# EasyEDA Pro project rk3568_xc7a100t.eprj, schematic rk3568, sheets 1 to 6 of 9

## Sheets
1 rk3568_bottom: Board Name: rk3568_xc7a100t; Create Date: 2024-07-31; Company: LT; Drawed: LT; Page Size: A3
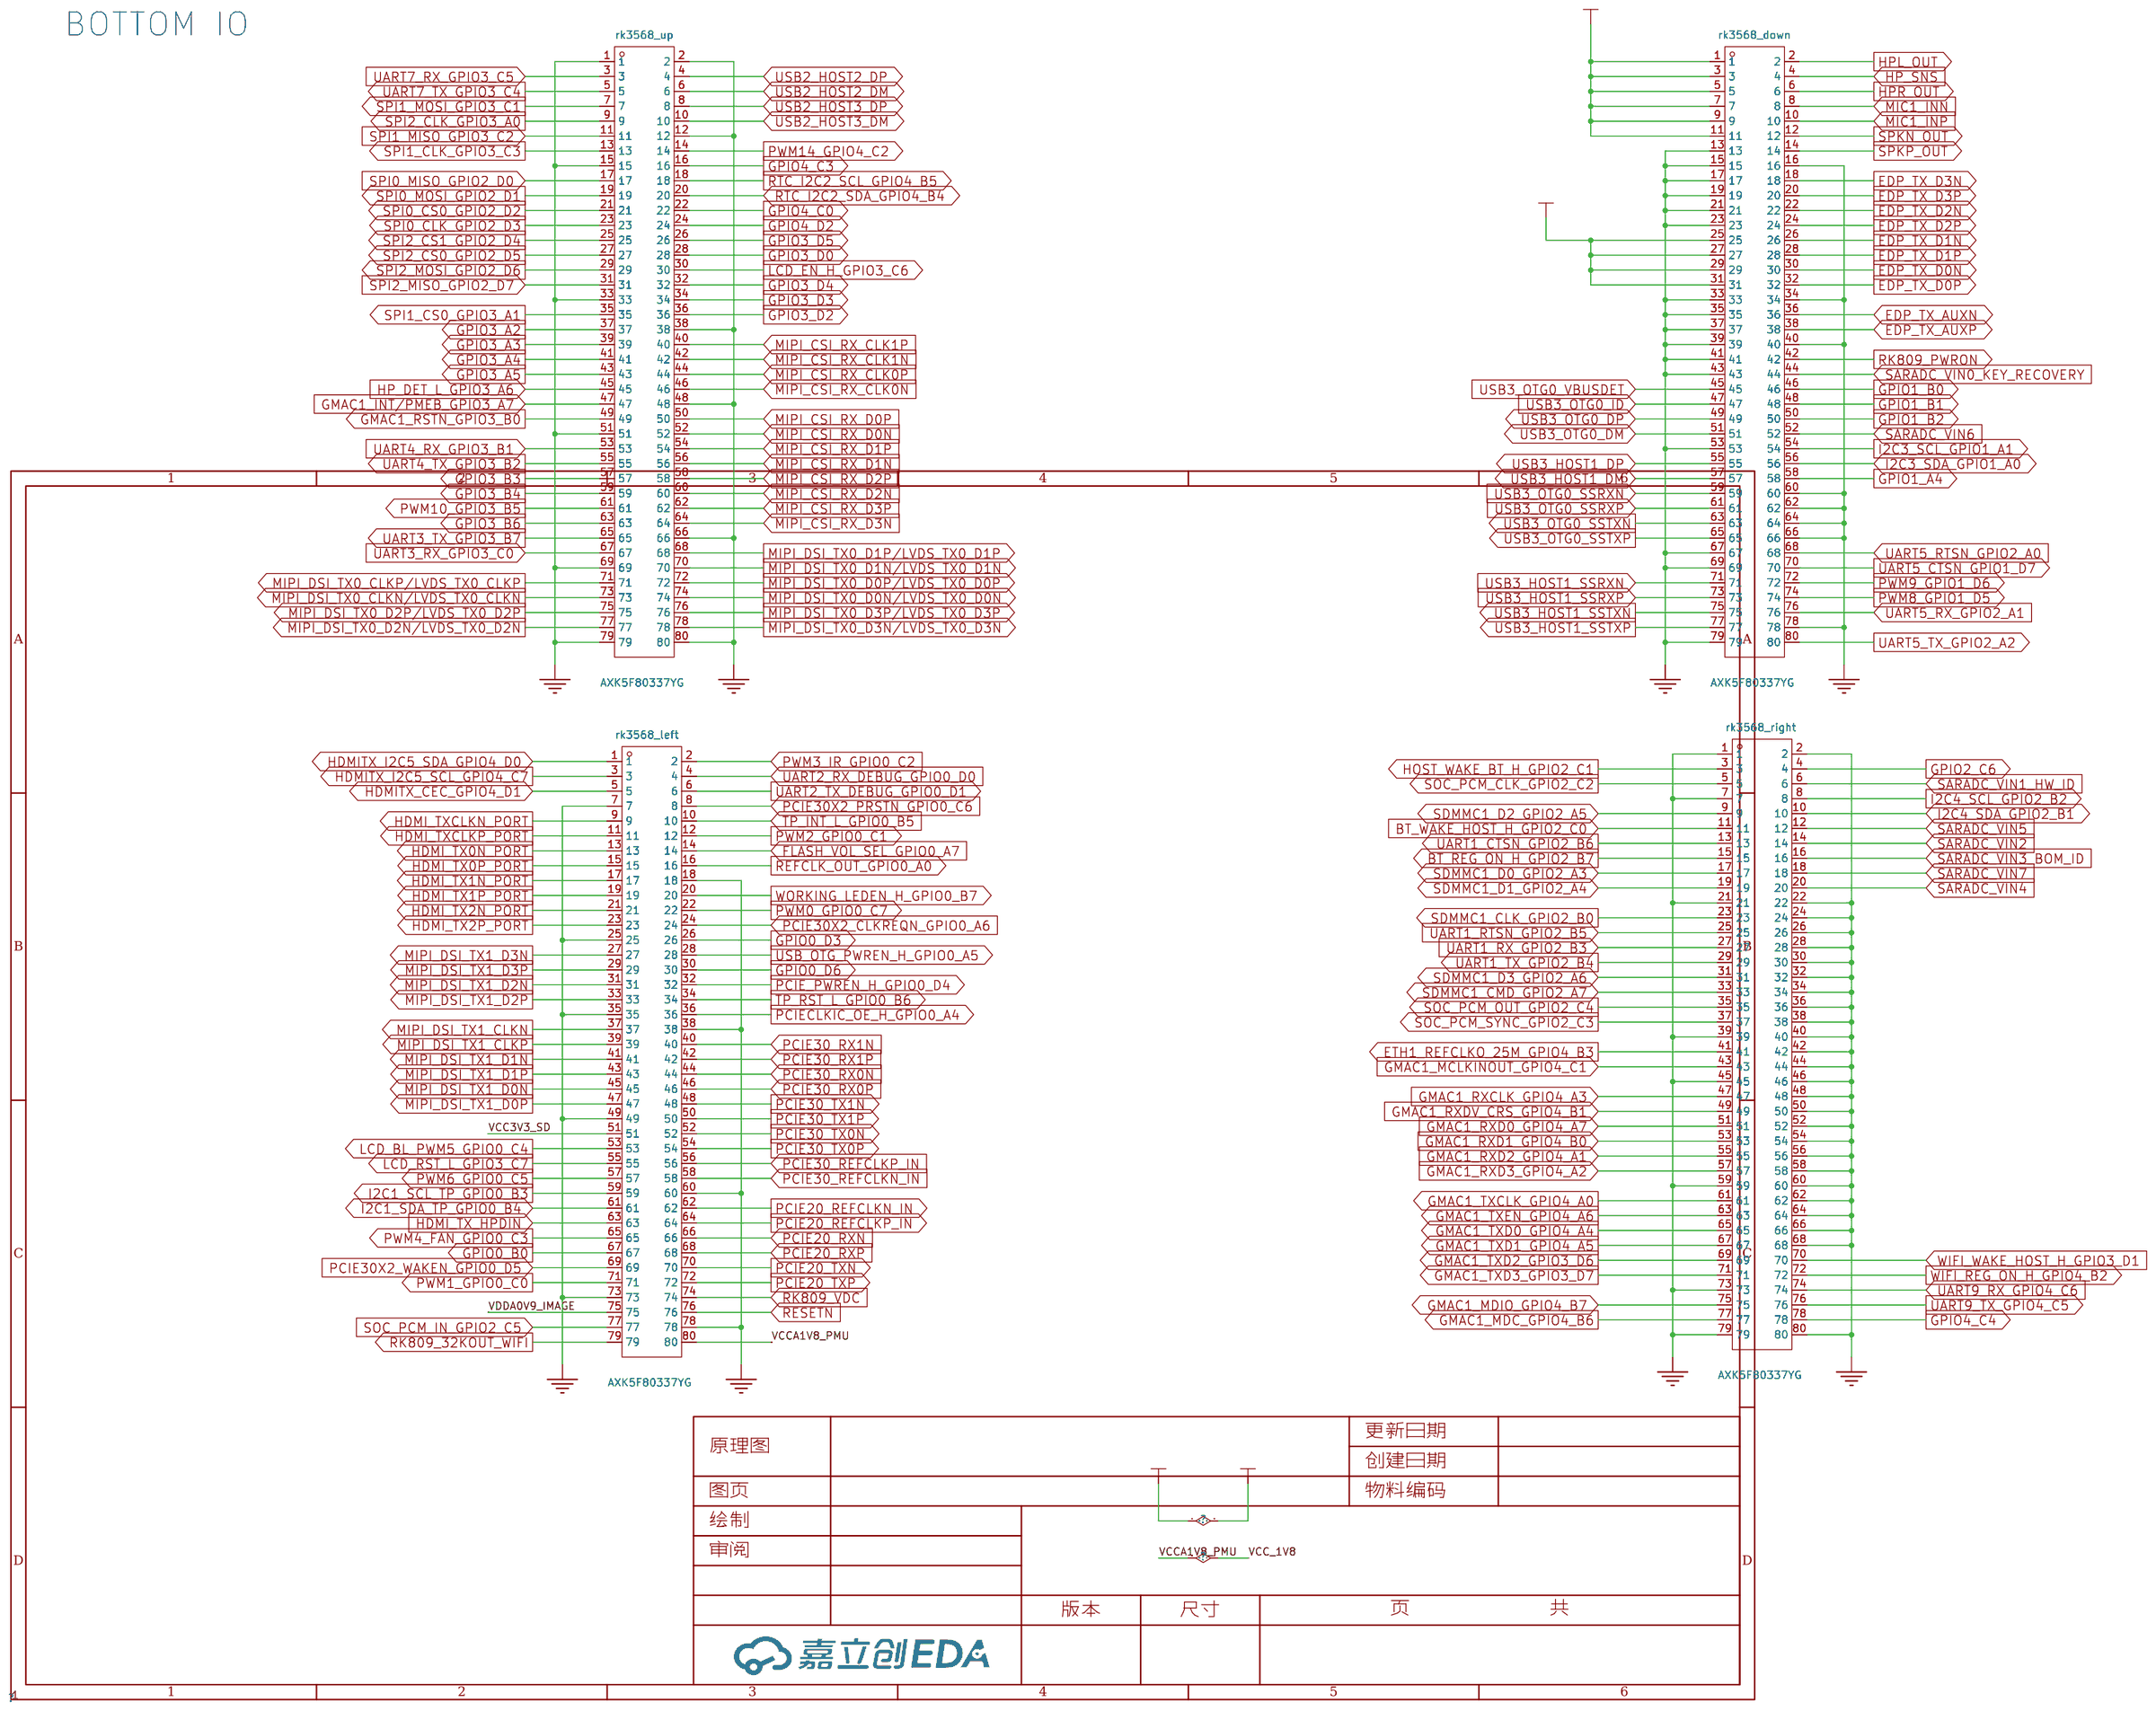
[diagram p0: rk3568_bottom]
2 rk3568_power: Create Date: 2024-08-01
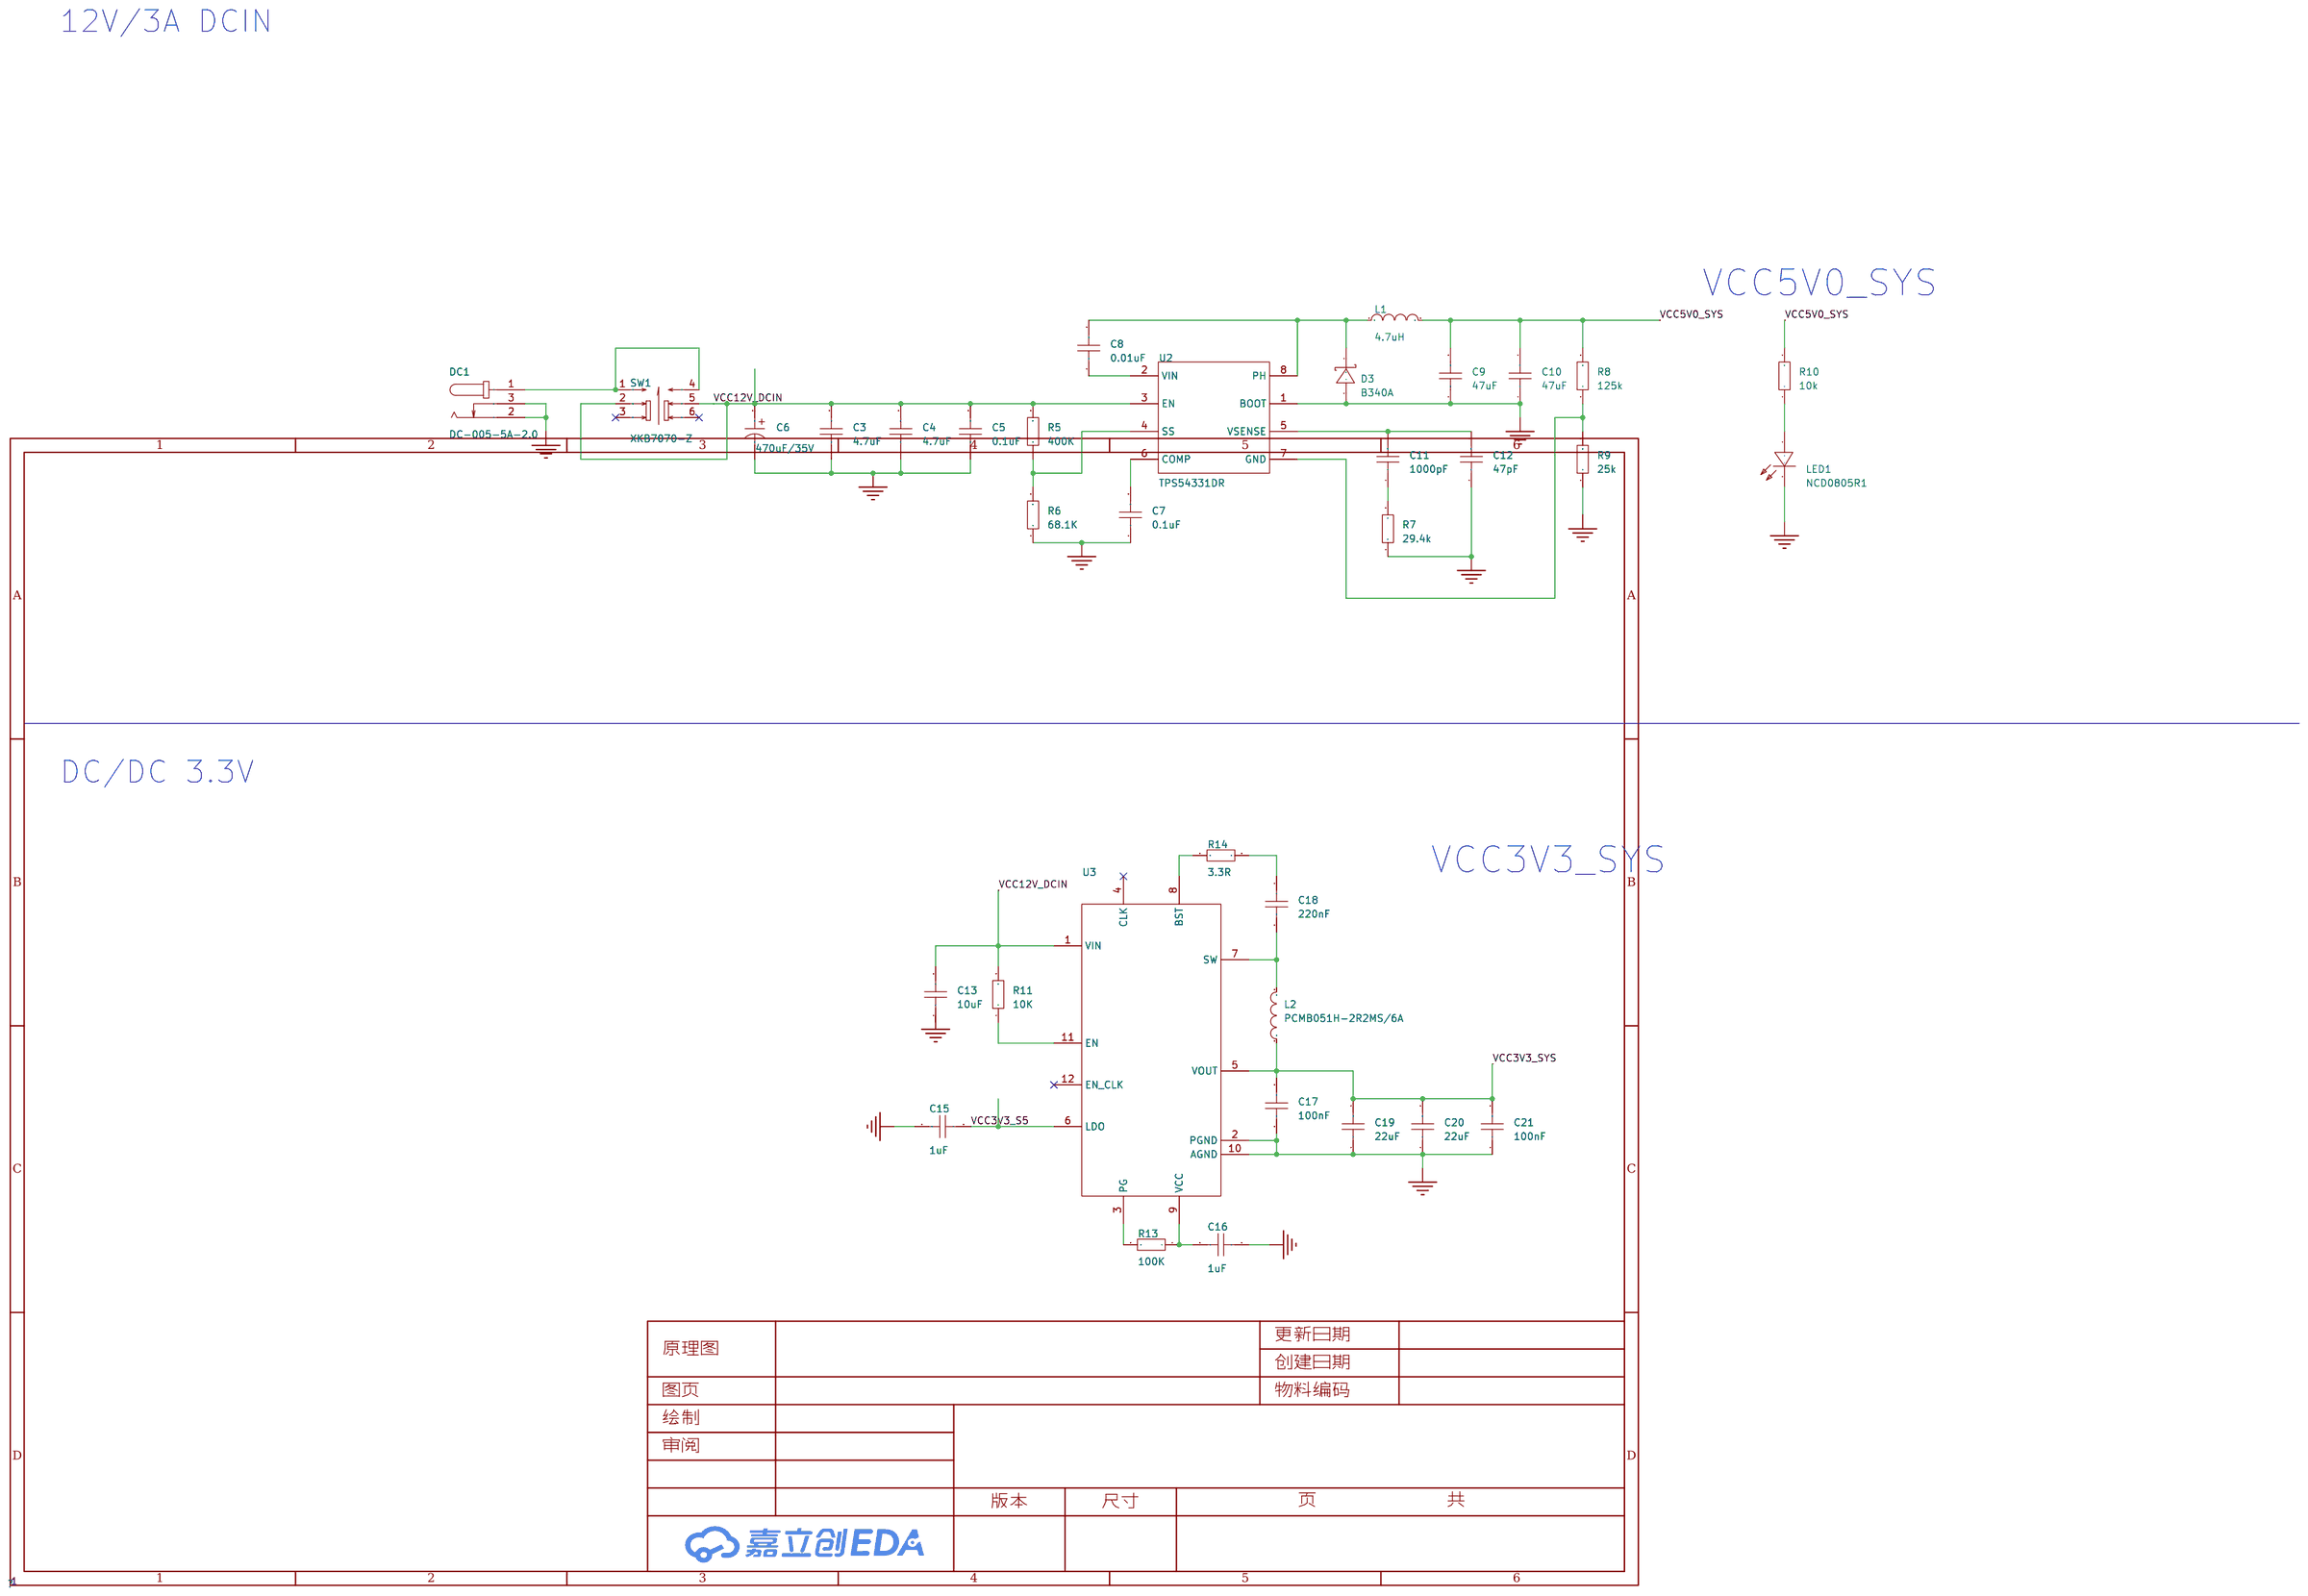
[diagram p1: rk3568_power]
3 rk3568_usb: Create Date: 2024-08-02
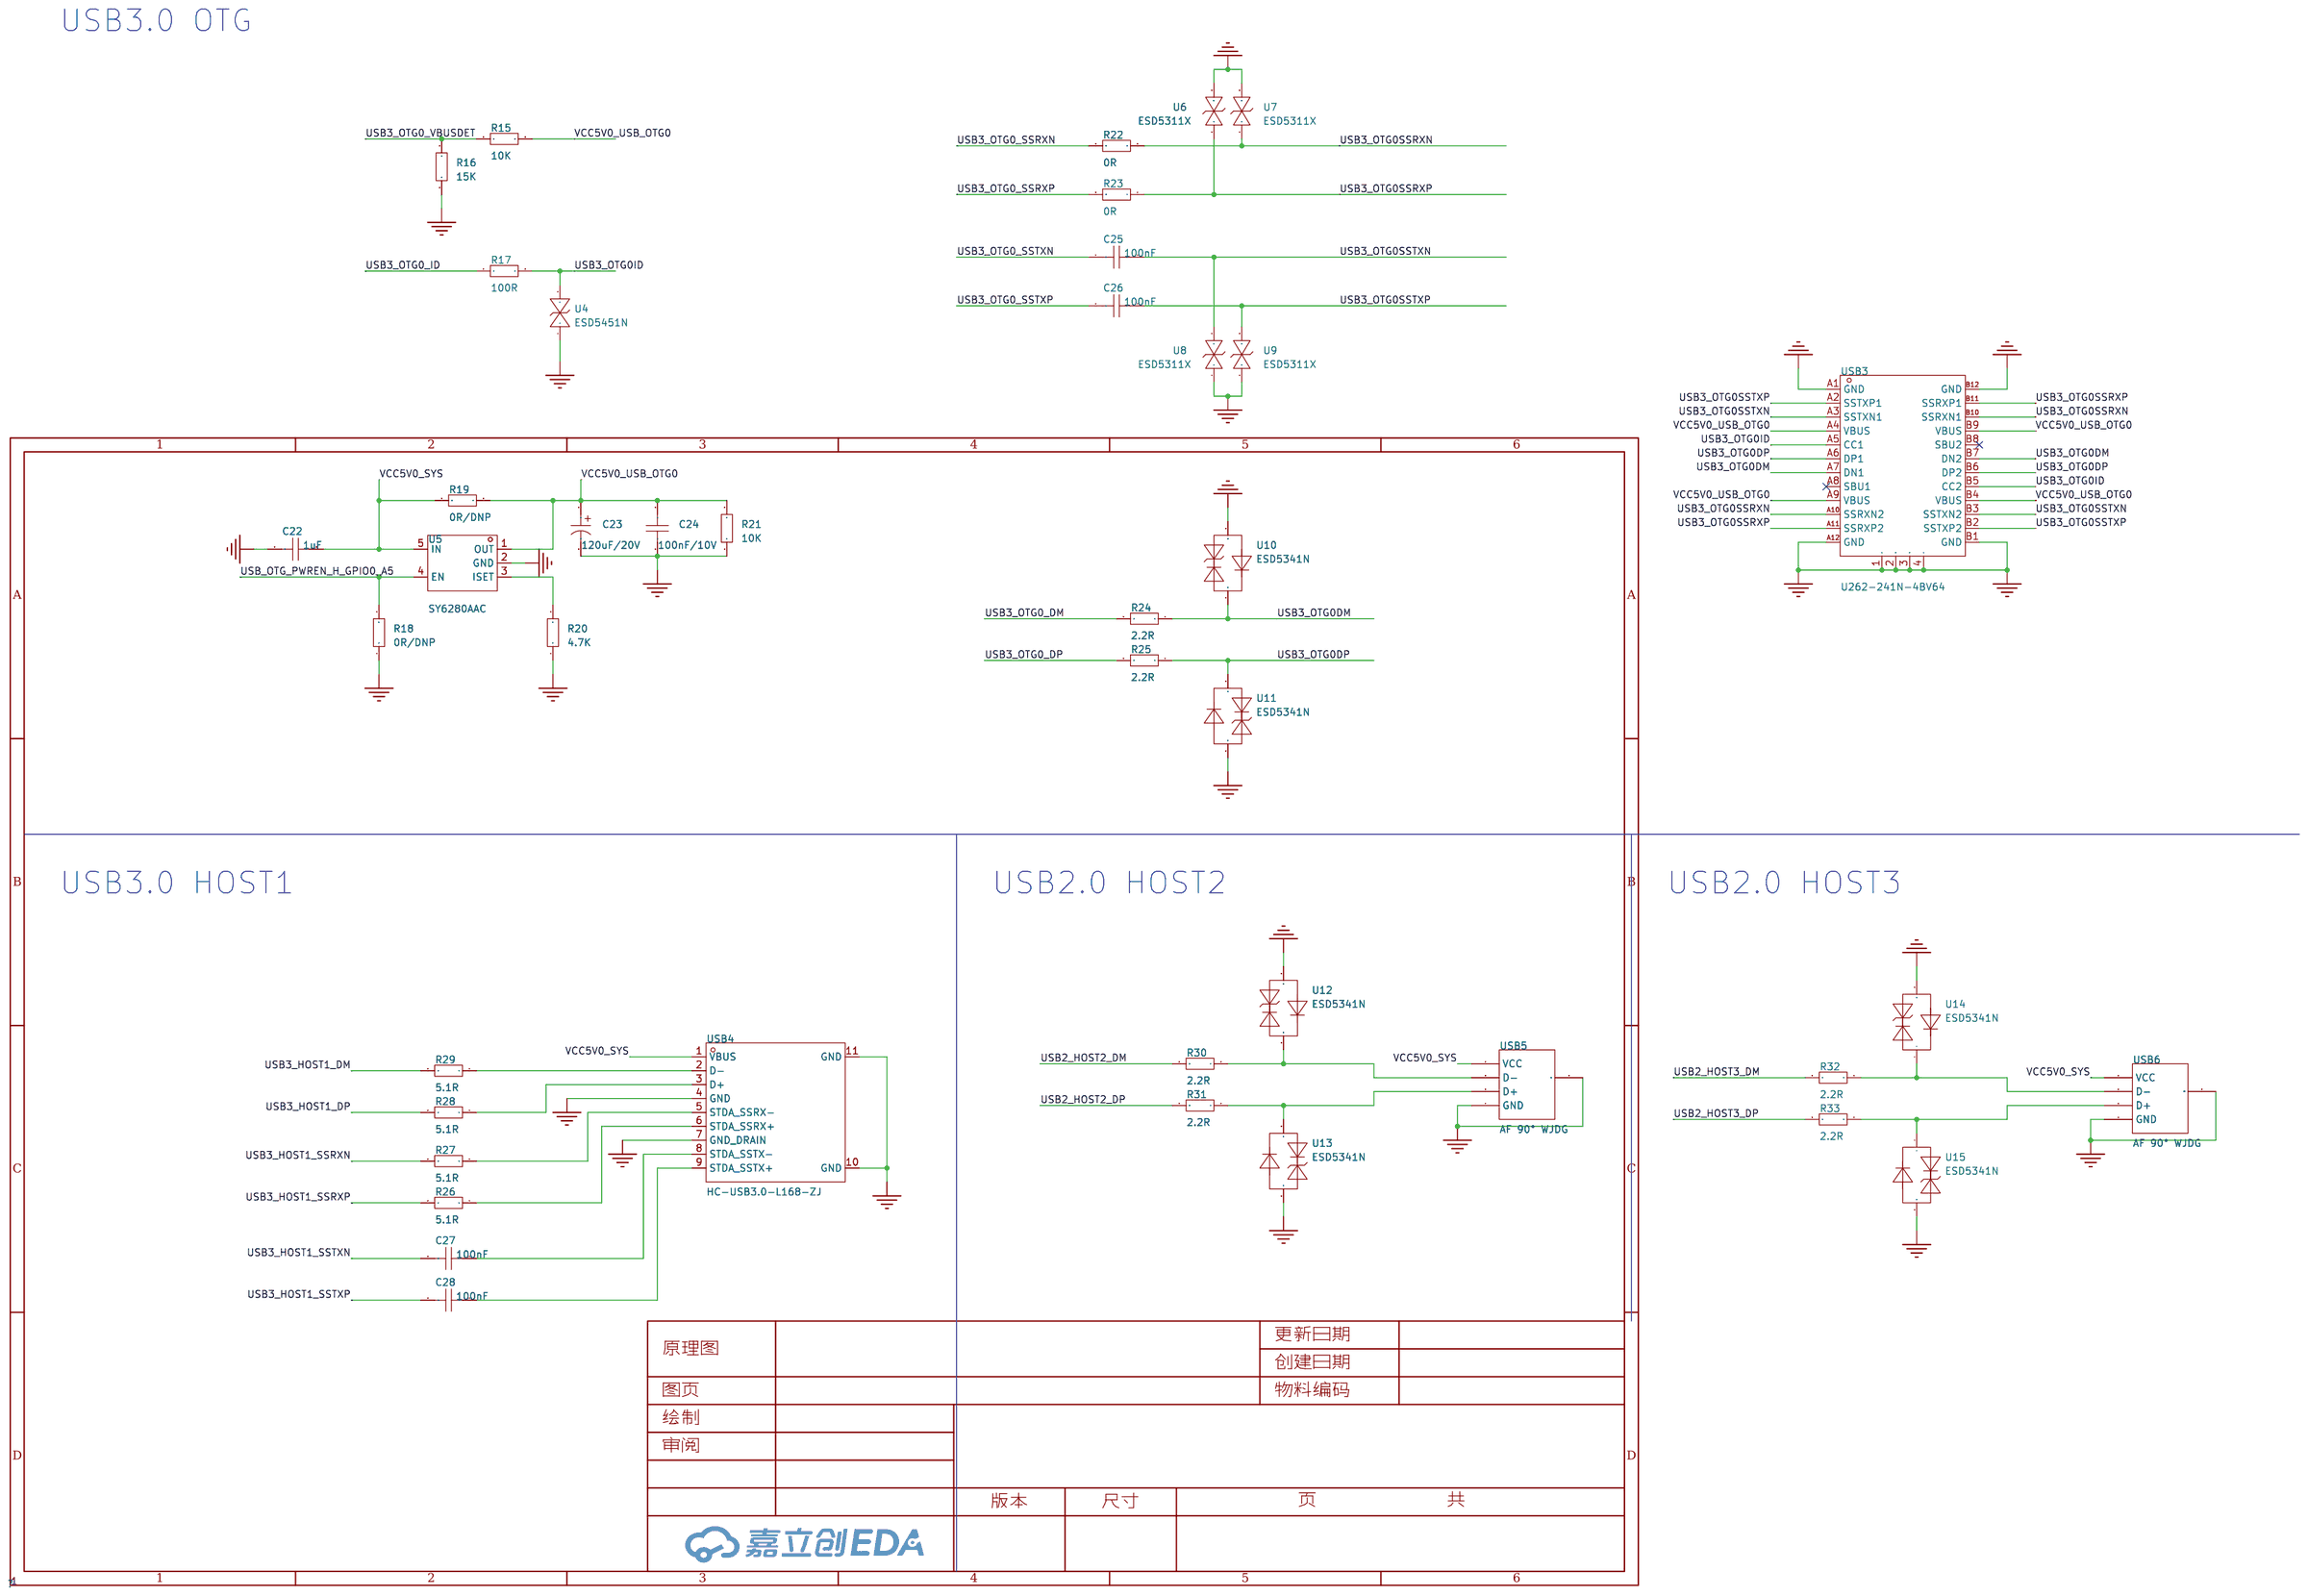
[diagram p2: rk3568_usb]
4 rk3568_mipi_hdmi: Create Date: 2024-08-02
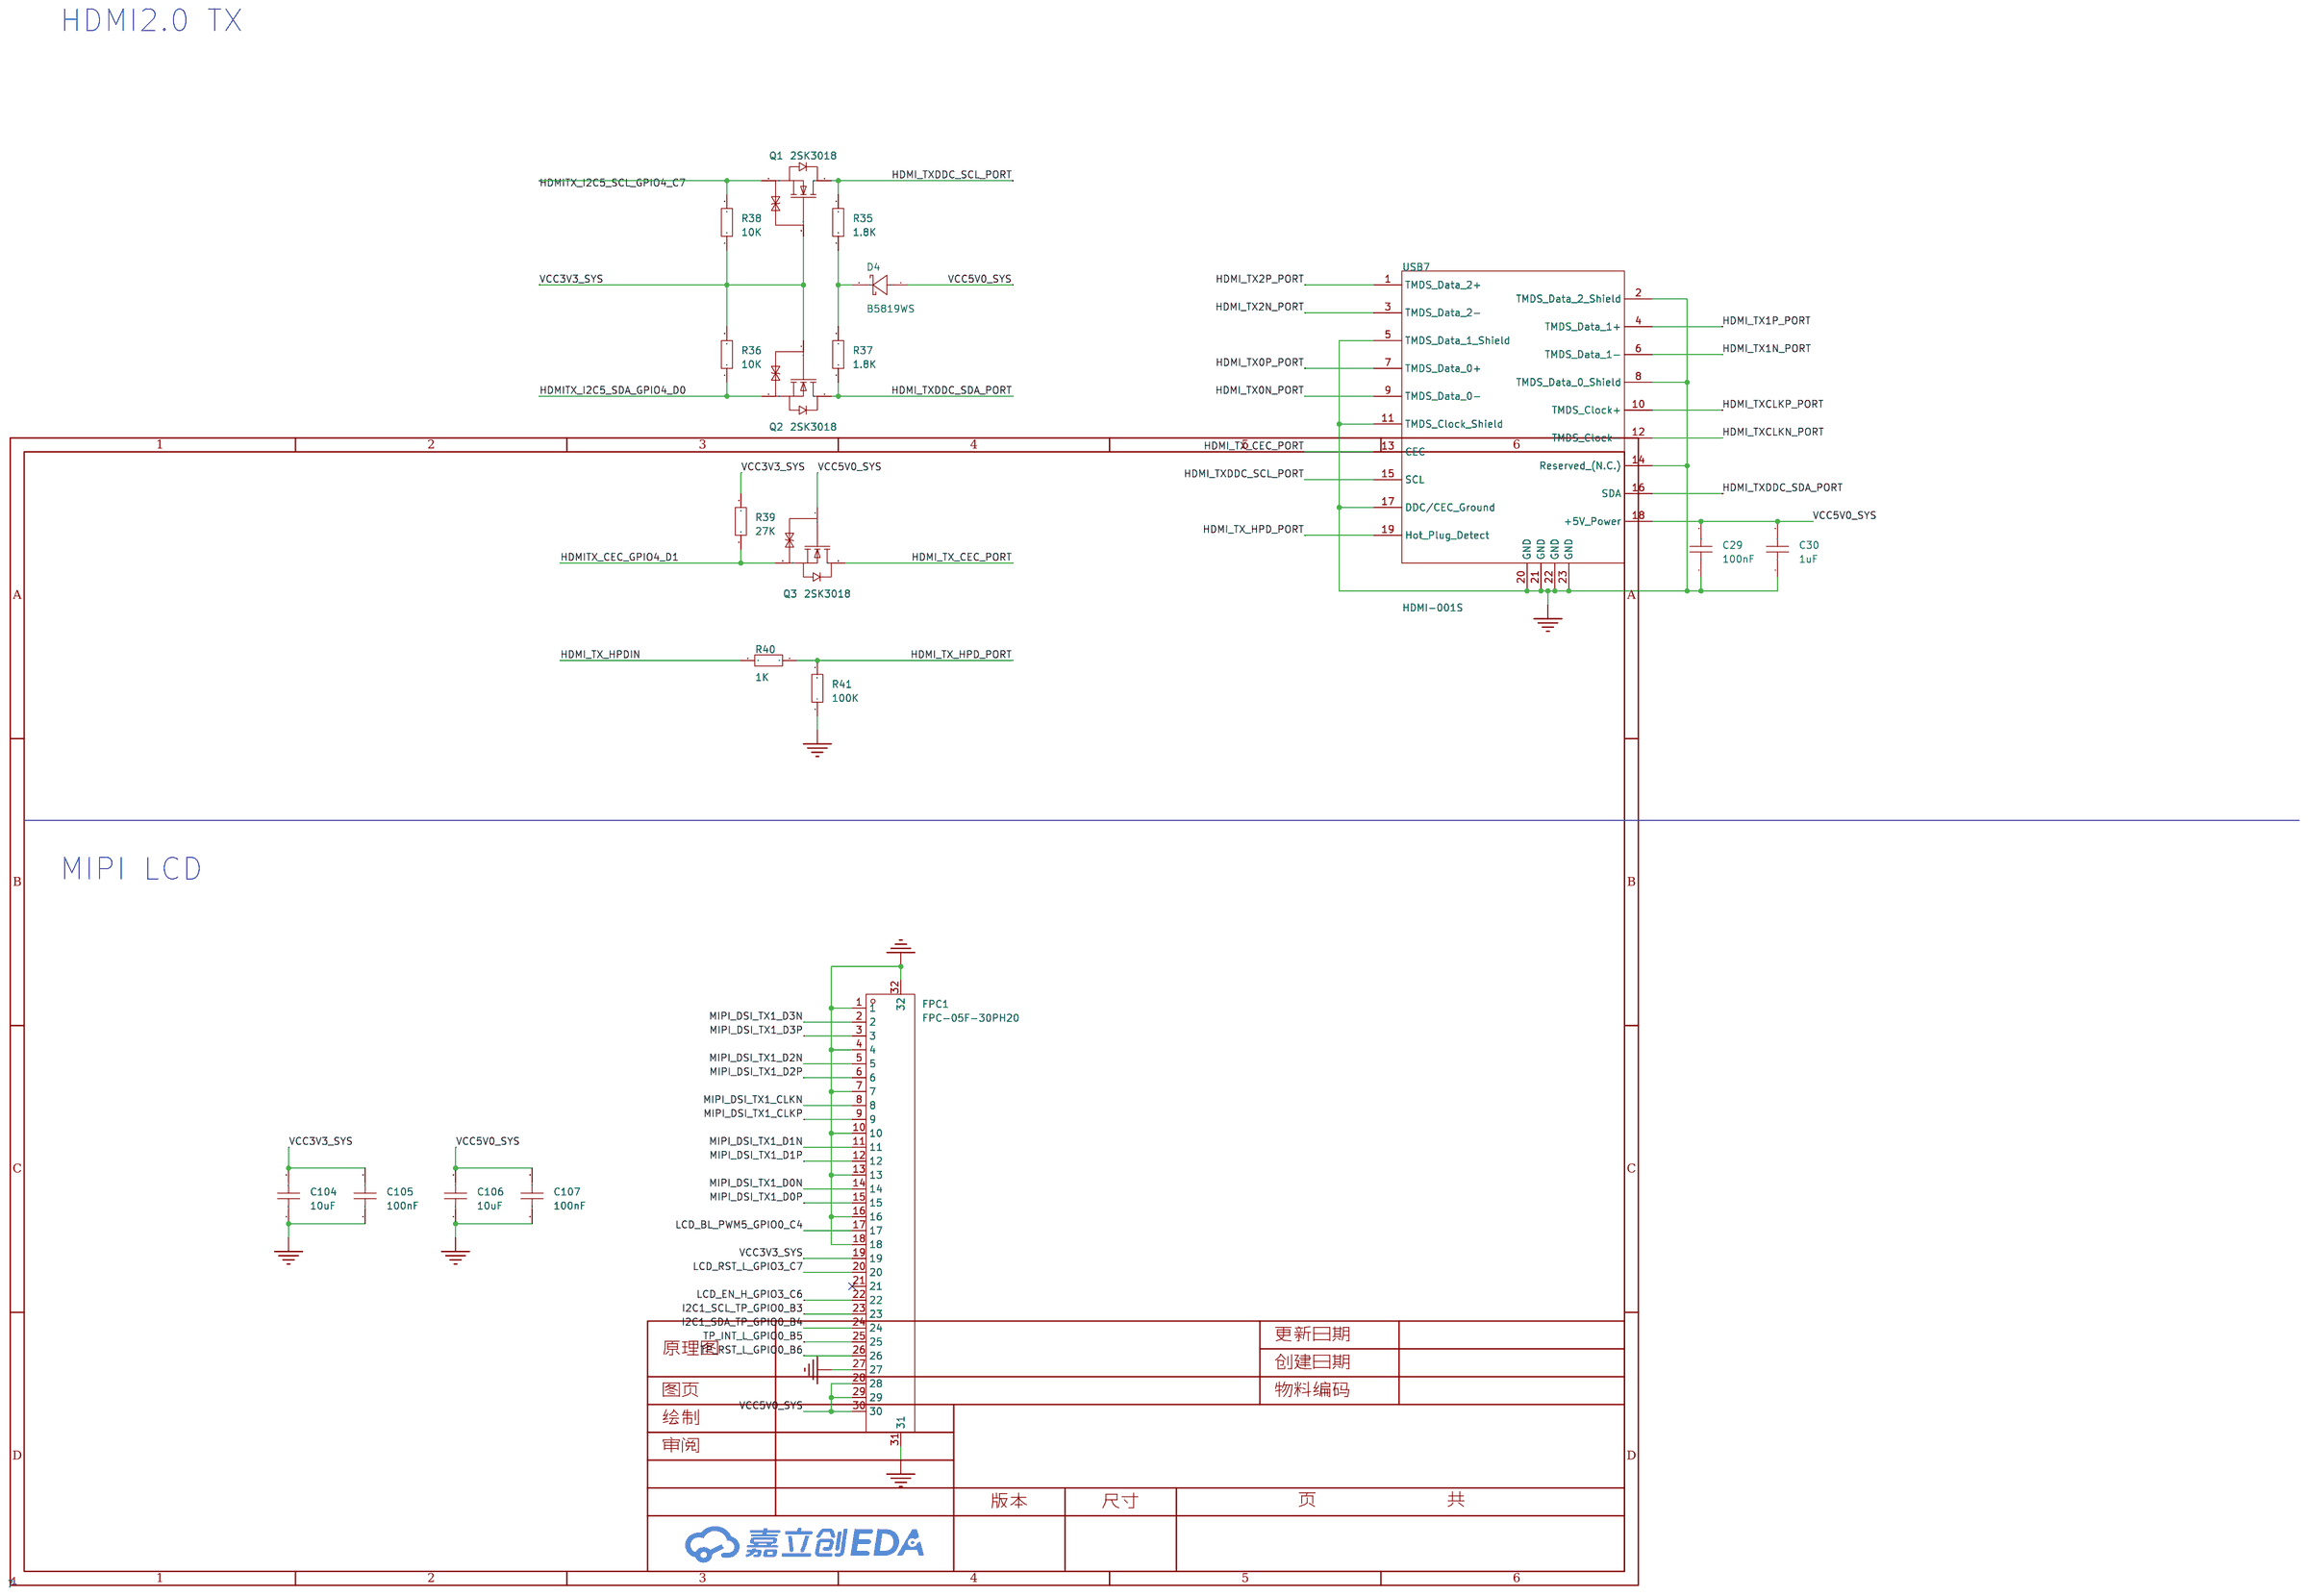
[diagram p3: rk3568_mipi_hdmi]
5 rk3568_sdio_wifi_bt: Create Date: 2024-08-02
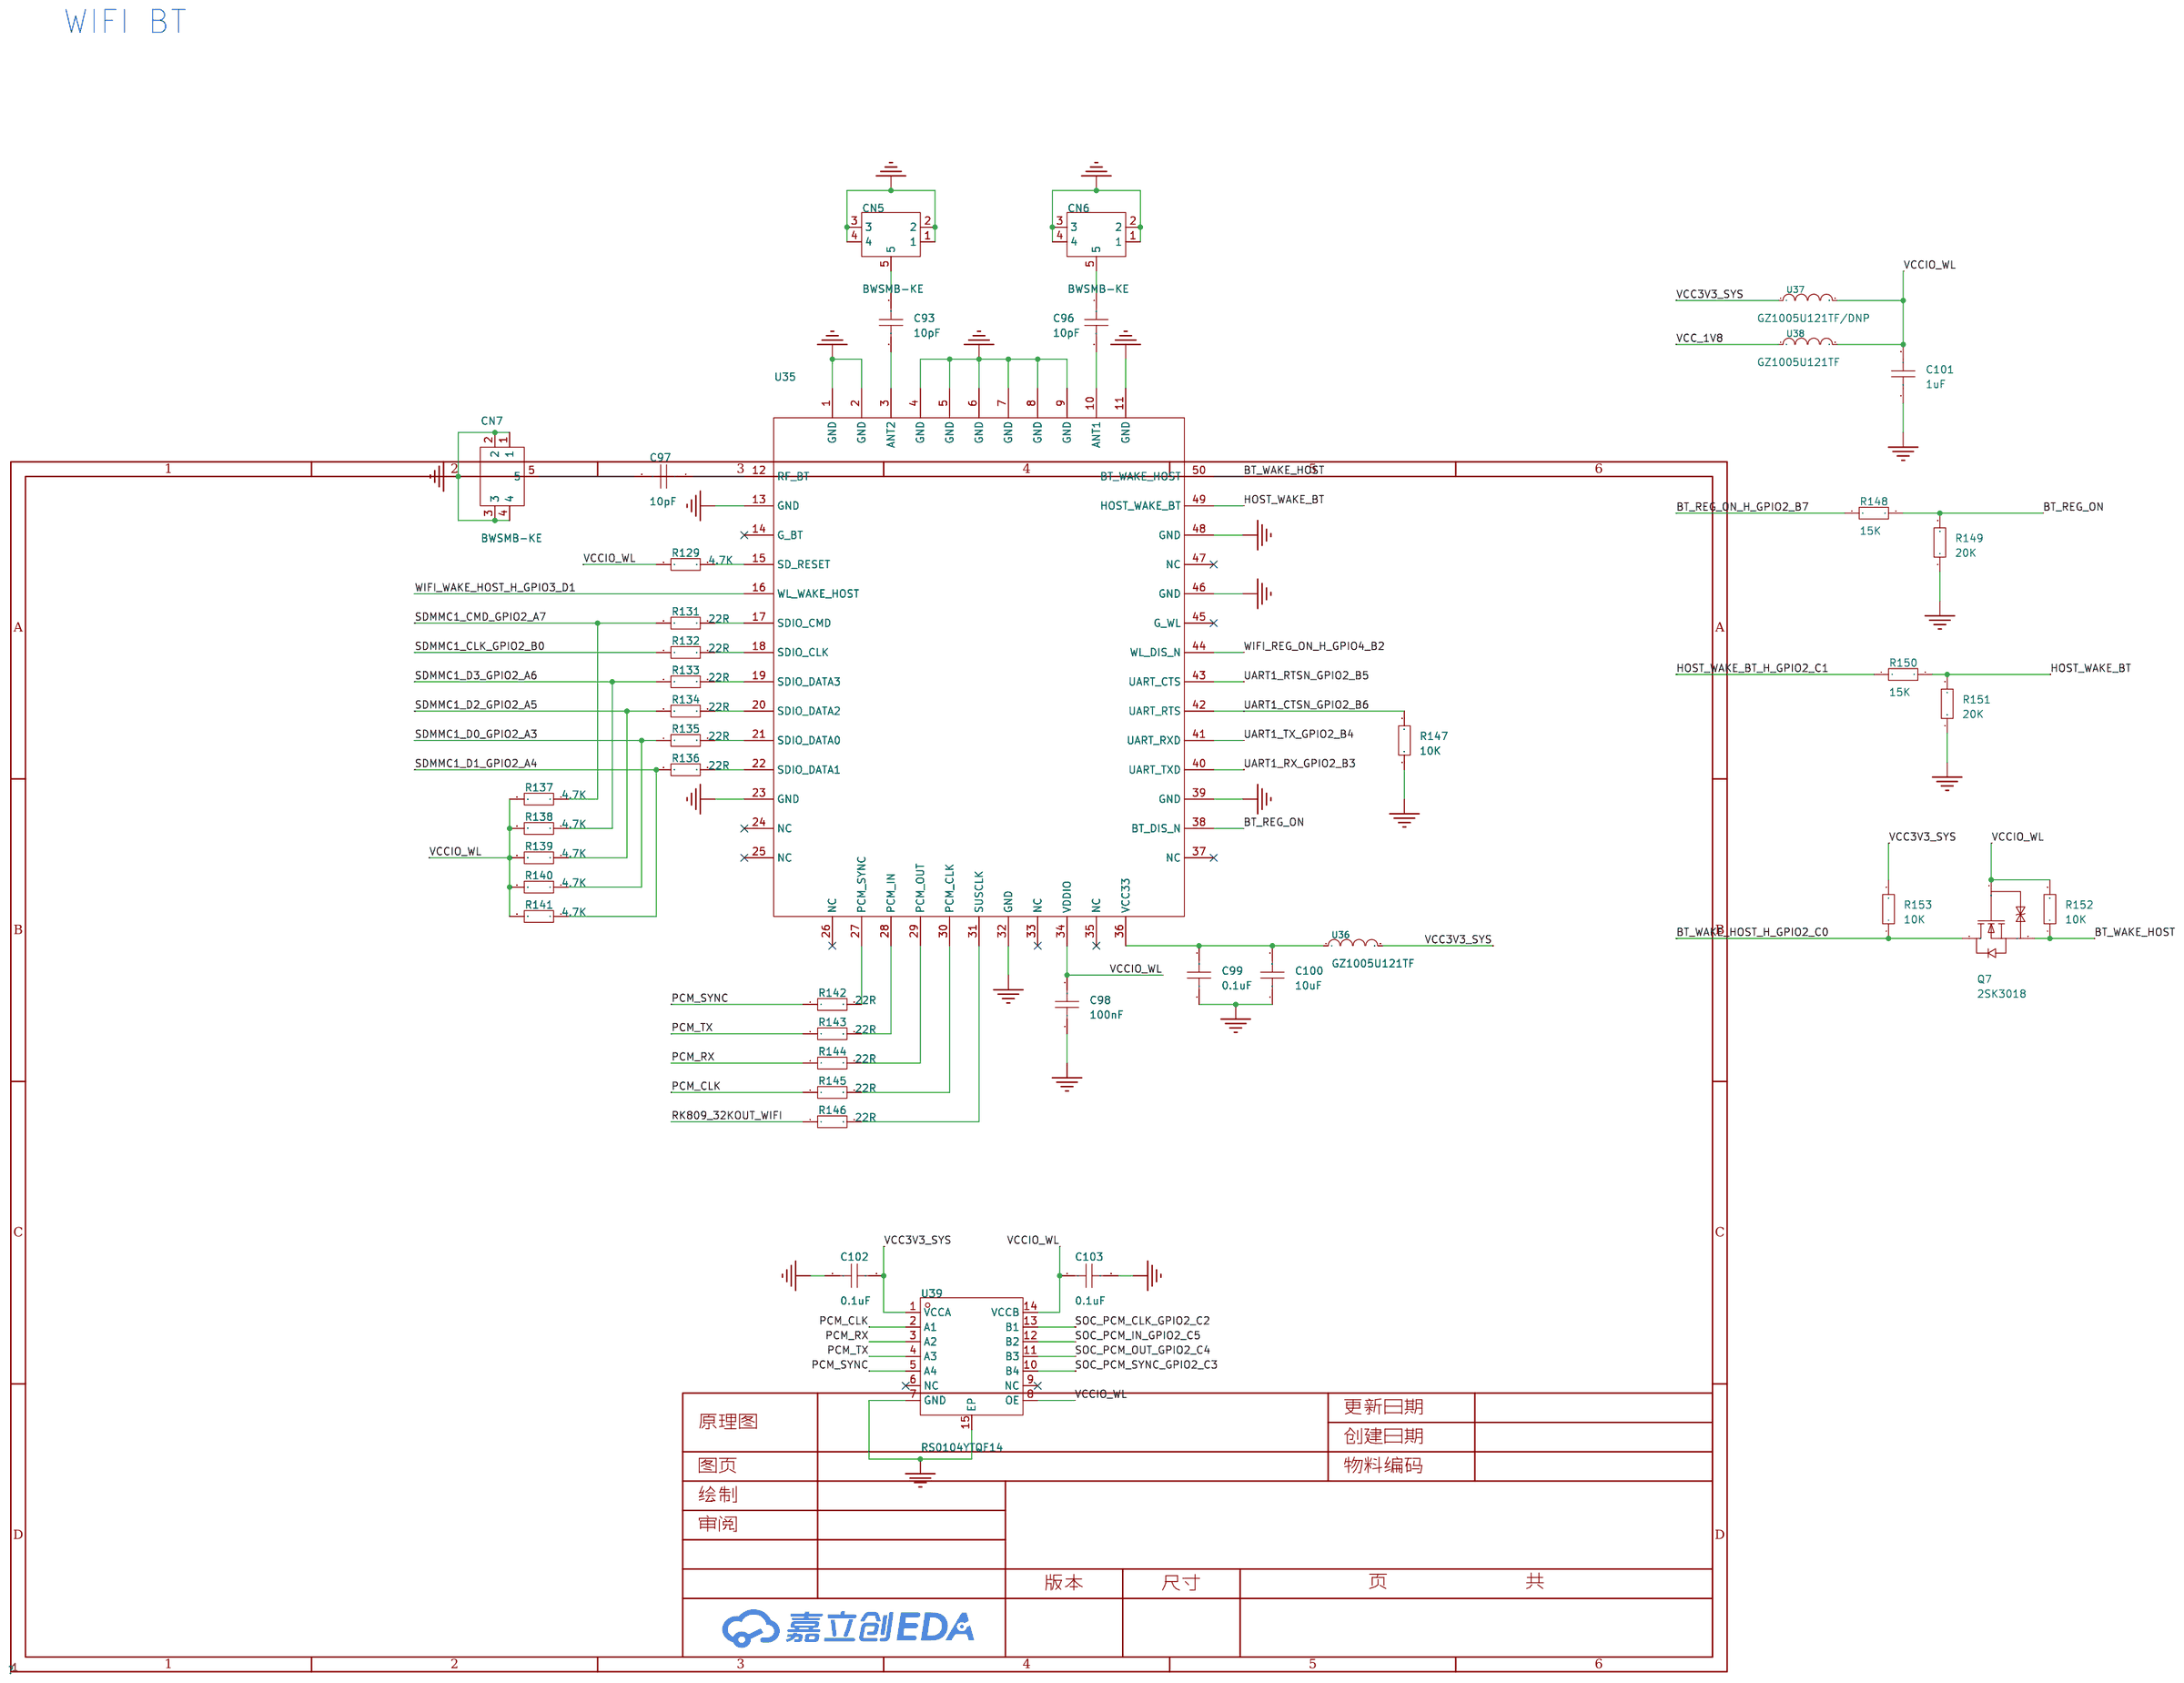
[diagram p4: rk3568_sdio_wifi_bt]
6 rk3568_gmac1_phy: Create Date: 2024-08-02
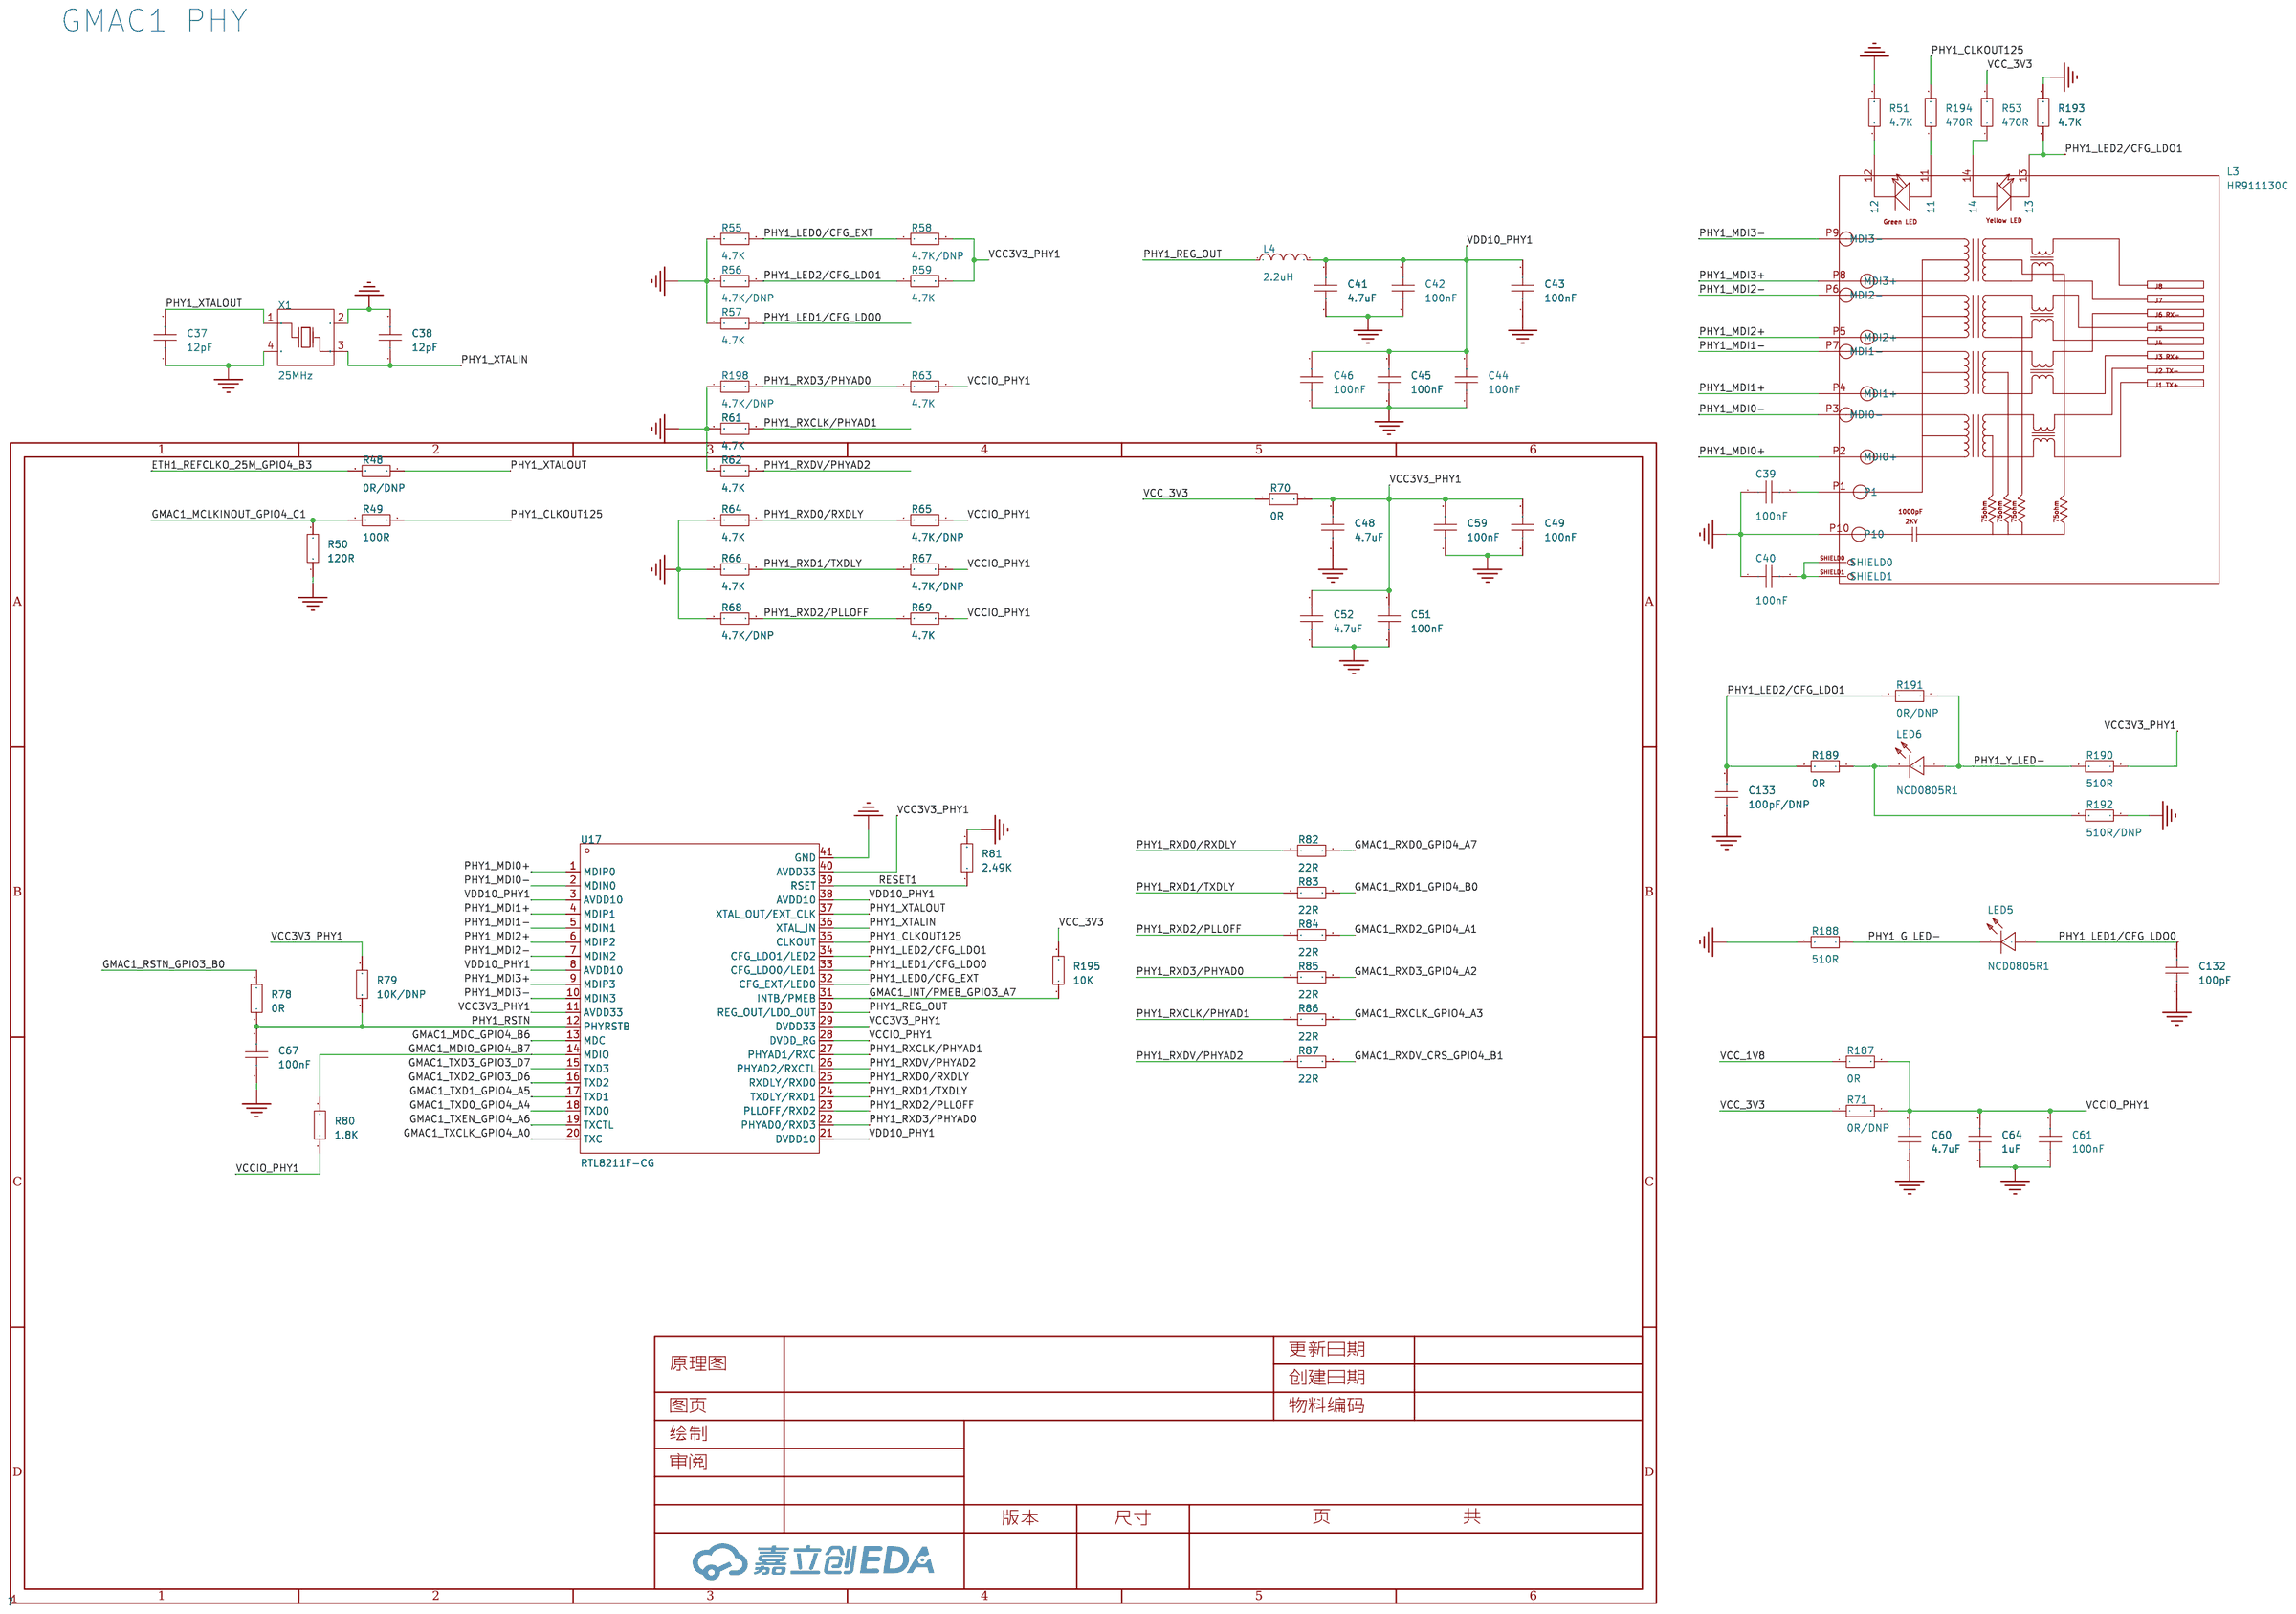
[diagram p5: rk3568_gmac1_phy]

## Parts
sheet rk3568_bottom
rk3568_down  AXK5F80337YG  [CONN-SMD_80P-P0.50_AXK5F80337YG]
rk3568_left  AXK5F80337YG  [CONN-SMD_80P-P0.50_AXK5F80337YG]
rk3568_right  AXK5F80337YG  [CONN-SMD_80P-P0.50_AXK5F80337YG]
rk3568_up  AXK5F80337YG  [CONN-SMD_80P-P0.50_AXK5F80337YG]
sheet rk3568_gmac1_phy
C37  12pF  [C0603]
C38  12pF  [C0603]
C39  100nF  [C0603]
C40  100nF  [C0603]
C41  4.7uF  [C0603]
C42  100nF  [C0603]
C43  100nF  [C0603]
C44  100nF  [C0603]
C45  100nF  [C0603]
C46  100nF  [C0603]
C48  4.7uF  [C0603]
C49  100nF  [C0603]
C51  100nF  [C0603]
C52  4.7uF  [C0603]
C59  100nF  [C0603]
C60  4.7uF  [C0603]
C61  100nF  [C0603]
C64  1uF  [C0603]
C67  100nF  [C0603]
C132  100pF  [C0603]
C133  100pF/DNP  [C0603]
L3  HR911130C  [RJ45-TH_HR911130C]
L4  2.2uH  [L0805]
LED5  NCD0805R1  [LED0805-R-RD]
LED6  NCD0805R1  [LED0805-R-RD]
R48  0R/DNP  [R0603]
R49  100R  [R0603]
R50  120R  [R0603]
R51  4.7K  [R0603]
R53  470R  [R0603]
R55  4.7K  [R0603]
R56  4.7K/DNP  [R0603]
R57  4.7K  [R0603]
R58  4.7K/DNP  [R0603]
R59  4.7K  [R0603]
R61  4.7K  [R0603]
R62  4.7K  [R0603]
R63  4.7K  [R0603]
R64  4.7K  [R0603]
R65  4.7K/DNP  [R0603]
R66  4.7K  [R0603]
R67  4.7K/DNP  [R0603]
R68  4.7K/DNP  [R0603]
R69  4.7K  [R0603]
R70  0R  [R0603]
R71  0R/DNP  [R0603]
R78  0R  [R0603]
R79  10K/DNP  [R0603]
R80  1.8K  [R0603]
R81  2.49K  [R0603]
R82  22R  [R0603]
R83  22R  [R0603]
R84  22R  [R0603]
R85  22R  [R0603]
R86  22R  [R0603]
R87  22R  [R0603]
R187  0R  [R0603]
R188  510R  [R0603]
R189  0R  [R0603]
R190  510R  [R0603]
R191  0R/DNP  [R0603]
R192  510R/DNP  [R0603]
R193  4.7K  [R0603]
R194  470R  [R0603]
R195  10K  [R0603]
R198  4.7K/DNP  [R0603]
U17  RTL8211F-CG  [WQFN-40_L5.0-W5.0-P0.4-BL-EP]
X1  25MHz  [OSC-SMD_4P-L3.2-W2.5-BL]
sheet rk3568_mipi_hdmi
C29  100nF  [C0603]
C30  1uF  [C0603]
C104  10uF  [C0603]
C105  100nF  [C0603]
C106  10uF  [C0603]
C107  100nF  [C0603]
D4  B5819WS  [SOD-323_L1.7-W1.3-LS2.5-FD]
FPC1  FPC-05F-30PH20  [FPC-SMD_30P-P0.50_XUNPU_FPC-05F-30PH20]
Q1  2SK3018  [SOT-323-3_L2.0-W1.3-P1.30-LS2.1-BR]
Q2  2SK3018  [SOT-323-3_L2.0-W1.3-P1.30-LS2.1-BR]
Q3  2SK3018  [SOT-323-3_L2.0-W1.3-P1.30-LS2.1-BR]
R35  1.8K  [R0603]
R36  10K  [R0603]
R37  1.8K  [R0603]
R38  10K  [R0603]
R39  27K  [R0603]
R40  1K  [R0603]
R41  100K  [R0603]
USB7  HDMI-001S  [HDMI-SMD_HDMI-001S]
sheet rk3568_power
C3  4.7uF  [C0603]
C4  4.7uF  [C0603]
C5  0.1uF  [C0603]
C6  470uF/35V  [CAP-SMD_BD6.3-L6.6-W6.6-LS7.4-FD]
C7  0.1uF  [C0603]
C8  0.01uF  [C0603]
C9  47uF  [C0603]
C10  47uF  [C0603]
C11  1000pF  [C0603]
C12  47pF  [C0603]
C13  10uF  [C0603]
C15  1uF  [C0603]
C16  1uF  [C0603]
C17  100nF  [C0603]
C18  220nF  [C0603]
C19  22uF  [C0603]
C20  22uF  [C0603]
C21  100nF  [C0603]
D3  B340A  [SMA_L4.3-W2.6-LS5.1-RD]
DC1  DC-005-5A-2.0  [DC-IN-TH_DC-005-5A-2.0]
L1  4.7uH  [L0603]
L2  PCMB051H-2R2MS/6A  [IND-SMD_L5.4-W5.2]
LED1  NCD0805R1  [LED0805-R-RD]
R5  400K  [R0603]
R6  68.1K  [R0603]
R7  29.4k  [R0603]
R8  125k  [R0603]
R9  25k  [R0603]
R10  10k  [R0603]
R11  10K  [R0603]
R13  100K  [R0603]
R14  3.3R  [R0603]
SW1  XKB7070-Z  [SW-TH_6P-L7.0-W7.0-P2.00]
U2  TPS54331DR  [SOIC-8_L5.0-W4.0-P1.27-LS6.0-BL]
U3  -  [QFN-12_NB680_MNP]
sheet rk3568_sdio_wifi_bt
C93  10pF  [C0603]
C96  10pF  [C0603]
C97  10pF  [C0603]
C98  100nF  [C0603]
C99  0.1uF  [C0603]
C100  10uF  [C0603]
C101  1uF  [C0603]
C102  0.1uF  [C0603]
C103  0.1uF  [C0603]
CN5  BWSMB-KE  [SMA-TH_SMA-KHD]
CN6  BWSMB-KE  [SMA-TH_SMA-KHD]
CN7  BWSMB-KE  [SMA-TH_SMA-KHD]
Q7  2SK3018  [SOT-23-3_L2.9-W1.4-P1.90-LS2.6-BR]
R129  4.7K  [R0603]
R131  22R  [R0603]
R132  22R  [R0603]
R133  22R  [R0603]
R134  22R  [R0603]
R135  22R  [R0603]
R136  22R  [R0603]
R137  4.7K  [R0603]
R138  4.7K  [R0603]
R139  4.7K  [R0603]
R140  4.7K  [R0603]
R141  4.7K  [R0603]
R142  22R  [R0603]
R143  22R  [R0603]
R144  22R  [R0603]
R145  22R  [R0603]
R146  22R  [R0603]
R147  10K  [R0603]
R148  15K  [R0603]
R149  20K  [R0603]
R150  15K  [R0603]
R151  20K  [R0603]
R152  10K  [R0603]
R153  10K  [R0603]
U35  -  [RTL8852BS]
U36  GZ1005U121TF  [L0402]
U37  GZ1005U121TF/DNP  [L0402]
U38  GZ1005U121TF  [L0402]
U39  RS0104YTQF14  [VQFN-14_L3.5-W3.5-P0.50-BL-EP2.0]
sheet rk3568_usb
C22  1uF  [C0603]
C23  120uF/20V  [CAP-SMD_BD6.3-L6.6-W6.6-LS7.4-FD]
C24  100nF/10V  [C0603]
C25  100nF  [C0603]
C26  100nF  [C0603]
C27  100nF  [C0603]
C28  100nF  [C0603]
R15  10K  [R0603]
R16  15K  [R0603]
R17  100R  [R0603]
R18  0R/DNP  [R0603]
R19  0R/DNP  [R0603]
R20  4.7K  [R0603]
R21  10K  [R0603]
R22  0R  [R0603]
R23  0R  [R0603]
R24  2.2R  [R0603]
R25  2.2R  [R0603]
R26  5.1R  [R0603]
R27  5.1R  [R0603]
R28  5.1R  [R0603]
R29  5.1R  [R0603]
R30  2.2R  [R0603]
R31  2.2R  [R0603]
R32  2.2R  [R0603]
R33  2.2R  [R0603]
U4  ESD5451N  [X1-DFN1006-2_L1.0-W0.6-P0.65-BI]
U5  SY6280AAC  [SOT-23-5_L3.0-W1.7-P0.95-LS2.8-BL]
U6  ESD5311X  [DFN1006-2L-BI]
U7  ESD5311X  [DFN1006-2L-BI]
U8  ESD5311X  [DFN1006-2L-BI]
U9  ESD5311X  [DFN1006-2L-BI]
U10  ESD5341N  [DFN1006-2L-RD]
U11  ESD5341N  [DFN1006-2L-RD]
U12  ESD5341N  [DFN1006-2L-RD]
U13  ESD5341N  [DFN1006-2L-RD]
U14  ESD5341N  [DFN1006-2L-RD]
U15  ESD5341N  [DFN1006-2L-RD]
USB3  U262-241N-4BV64  [USB-C-SMD_TYC-324G]
USB4  HC-USB3.0-L168-ZJ  [USB3.0-A-TH_HC-USB3.0-L168-ZJ]
USB5  AF 90° WJDG  [USB-A-TH_AF-WJDG]
USB6  AF 90° WJDG  [USB-A-TH_AF-WJDG]

## Library data of the parts
rk3568_down rk3568_left rk3568_right rk3568_up = AXK5F80337YG: LCSC Part Name: 间距:0.5mm 母 立贴; Supplier Part: C425110; Manufacturer: PANASONIC(松下); Supplier Footprint: SMD,P=0.5mm; JLCPCB Part Class: 扩展库; Datasheet: https://atta.szlcsc.com/upload/public/pdf/source/20220311/6F5DC41F043C9CF6954EB51995931AE2.pdf; Supplier: LCSC; Pitch: 0.5mm; Gender: 母; Mounting Style: 立贴; Number of Rows: 2; Contact Plating: 金
C3-C5 C7-C13 C15-C22 C24-C30 C37-C46 C48 C49 C51 C52 C59-C61 C64 C67 C93 C96-C107 C132 C133 = CAP_0603: Supplier Footprint: 0603
L3 = HR911130C: LCSC Part Name: 弯插 带LED; Supplier Part: C50933; Manufacturer: HANRUN(汉仁); Supplier Footprint: 插件; JLCPCB Part Class: 扩展库; Datasheet: https://atta.szlcsc.com/upload/public/pdf/source/20240108/FEC80AF9B295891E58BF4ACD53537D33.pdf; Supplier: LCSC; Connector Type: RJ45插座; Number of Ports: 1; Mounting Style: 弯插; Shielding: 有屏蔽; LED: 带LED
L4 = CMI201209U2R2KT: LCSC Part Name: 2.2uH ±10%; Supplier Part: C1043; Manufacturer: FH(风华); Supplier Footprint: 0805; JLCPCB Part Class: 扩展库; Datasheet: https://atta.szlcsc.com/upload/public/pdf/source/20230223/B5A9234764BD8EE53116685FAFCB16FA.pdf; Supplier: LCSC; Tolerance: ±10%; Rated Current: 50mA; DC Resistance (DCR): 600mΩ; Q @ Freq: 35@10MHz; Frequency - Self Resonant: 50MHz
LED1 LED5 LED6 = NCD0805R1: Supplier Part: C84256; Manufacturer: 国星光电; Supplier Footprint: 0805; JLCPCB Part Class: 基础库; Datasheet: https://atta.szlcsc.com/upload/public/pdf/source/20200820/C84256_F0A75A43B3EAD75808600A0514C76B99.pdf; Supplier: LCSC; Emitted Color: 红色; Forward Voltage (VF): 1.6V~2.6V; Power Dissipation: 65mW; Forward Current: 20mA; Dominant Wavelength: 615nm~630nm; Diode Configuration: 独立二极管; Lens Color: 无色透明透镜; Luminous Intensity: 67mcd~195mcd; Viewing Angle: 130°; Operating Temperature: -30℃~+85℃
R5-R11 R13-R33 R35-R41 R48-R51 R53 R55-R59 R61-R71 R78-R87 R129 R131-R153 R187-R195 R198 = Res_0603: Supplier Footprint: 0603
U17 = RTL8211F-CG: LCSC Part Name: 集成10/100/1000M以太网精密收发器; Supplier Part: C187932; Manufacturer: REALTEK(瑞昱); Supplier Footprint: WQFN-40-EP(5x5); JLCPCB Part Class: 扩展库; Datasheet: https://atta.szlcsc.com/upload/public/pdf/source/20190902/C187932_1913F3711F05FE1324DF2946D70D648D.pdf; Supplier: LCSC
X1 = X322525MOB4SI: LCSC Part Name: 25MHz ±10ppm 12pF; Supplier Part: C9006; Manufacturer: YXC(扬兴晶振); Supplier Footprint: SMD3225-4P; JLCPCB Part Class: 基础库; Datasheet: https://atta.szlcsc.com/upload/public/pdf/source/20240329/19D5F850207469550BEB00D7DFEDBC7A.pdf; Supplier: LCSC; Crystal Type: 贴片晶振; Normal temperature Frequency Tolerance: ±10ppm; External load capacitor: 12pF; Frequency Stability(Full temperature range): ±20ppm; Operating Temperature: -40℃~+85℃
D4 = B5819WS_C7420331: LCSC Part Name: 电压:40V 电流:1A; Supplier Part: C7420331; Manufacturer: 宏迦橙; Supplier Footprint: SOD-323; JLCPCB Part Class: 扩展库; Datasheet: https://atta.szlcsc.com/upload/public/pdf/source/20230828/03CA0F4F90DAE368A7153B7B5E4D0651.pdf; Supplier: LCSC; Diode Configuration: 独立式; Forward Voltage (Vf@If): 600mV@1.0A; Reverse Voltage (Vr): 40V; Average Rectified Current (Io): 1A; Reverse Leakage Current (Ir): 1mA@40V; Peak forward surge current: 10A
FPC1 = FPC-05F-30PH20: LCSC Part Name: 间距:0.5mm P数:30P 翻盖式 下接; Supplier Part: C2856808; Manufacturer: XUNPU(讯普); Supplier Footprint: SMD,P=0.5mm,卧贴; JLCPCB Part Class: 扩展库; Datasheet: https://atta.szlcsc.com/upload/public/pdf/source/20210922/C2856808_4E6DDE2793CFD9EF09B771A8BD3338A4.pdf; Supplier: LCSC; Locking Feature: 翻盖式; Contact Type: 下接; Number of Contacts: 30P; Pitch: 0.5mm; Mounting Type: 卧贴; FFC, FCB Thickness: 0.3mm; Height Above Board: 2mm; Operating Temperature Range: -25℃~+85℃
Q1-Q3 = 2SK3018_C194460: LCSC Part Name: N沟道 耐压:30V 电流:100mA; Supplier Part: C194460; Manufacturer: CJ(江苏长电/长晶); Supplier Footprint: SOT-323-3; JLCPCB Part Class: 扩展库; Datasheet: https://atta.szlcsc.com/upload/public/pdf/source/20180612/C194460_7DCC01674DB4E554C67F4CC0517F82F1.pdf; Supplier: LCSC; Type: N沟道; Drain Source Voltage (Vdss): 30V; Continuous Drain Current (Id): 100mA; Power Dissipation (Pd): 200mW; Drain Source On Resistance (RDS(on)@Vgs,Id): 8Ω@4V,10mA; Gate Threshold Voltage (Vgs(th)@Id): 1.5V; Input Capacitance (Ciss@Vds): 13pF; Reverse Transfer Capacitance (Crss@Vds): 4pF
USB7 = HDMI-001S: LCSC Part Name: HDMI 母 P数:19P; Supplier Part: C720616; Manufacturer: XUNPU(讯普); Supplier Footprint: SMD; JLCPCB Part Class: 扩展库; Datasheet: https://atta.szlcsc.com/upload/public/pdf/source/20230810/ECFF1CC9EF38DC7E290ED6B9AC4EFC06.pdf; Supplier: LCSC; Connector Type: HDMI; Gender: 母; Number of Pins: 19P; Mounting Style: 卧贴; Number of Rows: 1; Current Rating (Max): 500mA; Operating Temperature Range: -45℃~+85℃
C6 C23 = RVT100UF35V67RV0034: LCSC Part Name: 100uF ±20% 35V; Supplier Part: C2836442; Manufacturer: KNSCHA(科尼盛); Supplier Footprint: SMD,D6.3xL7.7mm; JLCPCB Part Class: 扩展库; Datasheet: https://atta.szlcsc.com/upload/public/pdf/source/20210528/C2836442_7F6389BF36F63F32D6DF3A507E8E95D6.pdf; Supplier: LCSC; Tolerance: ±20%; Rated Voltage: 35V; Ripple Current: 87mA@120kHz; φD: 6.3mm; L: 7.7mm; Lifetime @ Temp: 2000hrs@105℃; Operating Temperature: -55℃~+105℃
D3 = B340A: LCSC Part Name: 电压:40V 电流:3A; Supplier Part: C64982; Manufacturer: MDD(辰达半导体); Supplier Footprint: SMA(DO-214AC); JLCPCB Part Class: 扩展库; Datasheet: https://atta.szlcsc.com/upload/public/pdf/source/20230710/CC7CF81239BC87A7012E02A96905E83C.pdf; Supplier: LCSC; Diode Configuration: 独立式; Forward Voltage (Vf@If): 550mV@3A; Reverse Voltage (Vr): 40V; Rectified Current: 3A; Reverse Leakage Current (Ir): 500uA@40V
DC1 = DC-005-5A-2.0: LCSC Part Name: DC电源插座 内径:2mm 外径:6.2mm; Supplier Part: C381116; Manufacturer: XKB Connectivity(中国星坤); Supplier Footprint: 插件; JLCPCB Part Class: 扩展库; Datasheet: https://atta.szlcsc.com/upload/public/pdf/source/20211015/707A35F7AB6E89C57AAB641950105BB7.pdf; Supplier: LCSC; Connector Type: DC电源插座; Inside Contact Diameter: 2mm; Outside Contact Diameter: 6.2mm; Current Rating (Max): 5A; Voltage Rating (Max): 24V; Contact Material: 黄铜; Operating Temperature Range: -20℃~+70℃; Soldering Temperature(Max): 260℃
L1 = L_0603
L2 = PCMB051H-2R2MS/6A: Supplier: LCSC; Supplier Part: C9900003835; Manufacturer: null
SW1 = XKB7070-Z: LCSC Part Name: 按键开关   7*7插件自锁 蓝白黑; Supplier Part: C318863; Manufacturer: XKB Connectivity(中国星坤); Supplier Footprint: 插件; JLCPCB Part Class: 扩展库; Datasheet: https://atta.szlcsc.com/upload/public/pdf/source/20211015/75A682A27A424BDE8D93C2CFA14C38FE.pdf; Supplier: LCSC; Self Lock / No Lock: 自锁; Actuator Style: 矩形按钮; Mounting Style: 直插; Contact Current: 100mA; Voltage Rating (AC): 250V; Voltage Rating (DC): 30V; Insulation Resistance: 100MΩ; Actuator/Cap Color: 蓝色; With Lamp: 不带; Pin Style: PC引脚; Operating Force: 160gf; Operating Temperature: -15℃~+55℃; Mechanical Life: 10万次
U2 = TPS54331DR: Supplier Part: C9865; Manufacturer: TI(德州仪器); Supplier Footprint: SOIC-8; JLCPCB Part Class: 扩展库; Datasheet: https://www.ti.com/cn/lit/gpn/tps54331; Supplier: LCSC; Function: 降压型; Output Type: 可调; Input Voltage: 3.5V~28V; Output Voltage: 800mV~25V; Output Current (Max): 3A; Switching Frequency: 570kHz; Operating Temperature: -40℃~+150℃@(TJ); Synchronous Rectification: 否; Number of Outputs: 1; Topology: 降压式; Switch tube (built-in/external): 内置
U3 = NB680GD-P1
CN5-CN7 = BWSMB-KE: LCSC Part Name: SMB 内孔 正脚; Supplier Part: C5250063; Manufacturer: BAT WIRELESS(蝙蝠无线); Supplier Footprint: 插件; JLCPCB Part Class: 扩展库; Datasheet: https://atta.szlcsc.com/upload/public/pdf/source/20221109/E6E8445F507187F45FA4905F3CD78427.pdf; Supplier: LCSC; Interface Type: 内孔; Number of Ports: 1; Frequency-Max: 6GHz; RF Series: SMB; Impedance: 50Ω; Style: 正脚; Operating Temperature Range: -65℃~+165℃
Q7 = 2SK3018: Supplier Part: C727148; Manufacturer: TWGMC(台湾迪嘉); Supplier Footprint: SOT-23; JLCPCB Part Class: 扩展库; Datasheet: https://atta.szlcsc.com/upload/public/pdf/source/20200827/C727148_2301BBDB89FCE642A4A39ABEF7075607.pdf; Supplier: LCSC
U35 = RTL8852BS
U36-U38 = GZ1005U121TF: LCSC Part Name: 单路 0402磁珠 阻抗120Ω@100MHz; Supplier Part: C361515; Manufacturer: Sunlord(顺络); Supplier Footprint: 0402; JLCPCB Part Class: 扩展库; Datasheet: https://atta.szlcsc.com/upload/public/pdf/source/20231030/9B6A3E87682CEC1FF6638DFAA81D73FA.pdf; Supplier: LCSC; Impedance @ Frequency: 120Ω@100MHz; Tolerance: ±25%; DC Resistance: 400mΩ; Current Rating: 200mA; Circuits: 1
U39 = RS0104YTQF14: Supplier Part: C5372421; Manufacturer: RUNIC(润石); Supplier Footprint: QFN-14L(3.5x3.5); JLCPCB Part Class: 扩展库; Datasheet: https://atta.szlcsc.com/upload/public/pdf/source/20230314/F3039FD895D3EBC408D1D722C8359295.pdf; Supplier: LCSC
U4 = ESD5451N_C2936977: LCSC Part Name: ESD二极管; Supplier Part: C2936977; Manufacturer: TECH PUBLIC(台舟); Supplier Footprint: DFN1006-2; JLCPCB Part Class: 扩展库; Datasheet: https://atta.szlcsc.com/upload/public/pdf/source/20211227/D040CF3F0222548C5BD9F7E690946783.pdf; Supplier: LCSC
U5 = SY6280AAC_C55136: Supplier Part: C55136; Manufacturer: silergy(矽力杰); Supplier Footprint: SOT-23-5; JLCPCB Part Class: 扩展库; Datasheet: https://atta.szlcsc.com/upload/public/pdf/source/20161108/1478586372822.pdf; Supplier: LCSC
U6-U9 = ESD5311X_C2844730: Supplier Part: C2844730; Manufacturer: TECH PUBLIC(台舟); Supplier Footprint: DFN1006-2; JLCPCB Part Class: 扩展库; Datasheet: https://atta.szlcsc.com/upload/public/pdf/source/20210709/C2844730_C8067B3CCE558E7D499244211FB5DC21.pdf; Supplier: LCSC; Type: ESD
U10-U15 = ESD5341N: Supplier Part: C3021106; Manufacturer: TECH PUBLIC(台舟); Supplier Footprint: DFN1006-2; JLCPCB Part Class: 扩展库; Datasheet: https://atta.szlcsc.com/upload/public/pdf/source/20220523/015141712EEA5B55BE540B4E0C7934DA.pdf; Supplier: LCSC
USB3 = U262-241N-4BV64: LCSC Part Name: Type-C 母 卧贴; Supplier Part: C388660; Manufacturer: XKB Connectivity(中国星坤); Supplier Footprint: SMD; JLCPCB Part Class: 扩展库; Datasheet: https://atta.szlcsc.com/upload/public/pdf/source/20211015/8B22A47B12BDC5CD319611427B3C1C1B.pdf; Supplier: LCSC; Connector Type: Type-C; Standard: USB 3.1; Gender: 母; Number of Ports: 1; Number of Contacts: 24P; Mounting Style: 卧贴; Current Rating - Power (Max): 5A; Contact Material: 高导铜; Contact Plating: 金; Operating Temperature Range: -40℃~+85℃; Soldering Temperature(Max): 260℃
USB4 = HC-USB3.0-L168-ZJ: LCSC Part Name: Type-A 母 弯插; Supplier Part: C7501860; Manufacturer: HC(虹成电子); Supplier Footprint: 插件; JLCPCB Part Class: Extended Part; Datasheet: https://atta.szlcsc.com/upload/public/pdf/source/20231110/E4BC62D5D5AF0E9F08F4D7C610B0A88D.pdf; Supplier: LCSC; Connector Type: Type-A; Standard: USB 3.0; Gender: 母; Number of Ports: 1; Number of Contacts: 9P; Mounting Style: 弯插; Current Rating - Power (Max): 1.5A; Contact Material: 黄铜; Contact Plating: 金; Operating Temperature Range: -25℃~+70℃; Soldering Temperature(Max): 235℃
USB5 USB6 = AF 90° WJDG: LCSC Part Name: Type-A 母 弯插; Supplier Part: C456018; Manufacturer: SHOU HAN(首韩); Supplier Footprint: 插件; JLCPCB Part Class: 扩展库; Datasheet: https://atta.szlcsc.com/upload/public/pdf/source/20191113/C456018_B104E062BEB8E11E57E63560E04EE13A.pdf; Supplier: LCSC; Connector Type: Type-A; Standard: USB 2.0; Gender: 母; Number of Ports: 1; Number of Contacts: 4P; Mounting Style: 弯插; Current Rating - Power (Max): 1.5A; Operating Temperature Range: -25℃~+85℃

## Nets
GND: C3.1 C4.1 C5.1 C6.2 C7.1 C9.1 C10.1 C12.1 C13.1 C15.2 C16.1 C17.2 C19.1 C20.1 C21.1 C22.1 C23.2 C24.1 C29.1 C30.1 C37.1 C38.2 C39.1 C40.1 C41.1 C42.1 C43.1 C44.1 C45.1 C46.1 C48.1 C49.1 C51.1 C52.1 C59.1 C60.1 C61.1 C64.1 C67.1 C98.1 C99.1 C100.1 C101.1 C102.1 C103.2 C104.1 C105.1 C106.1 C107.1 C132.1 C133.1 CN5.1 CN5.2 CN5.3 CN5.4 CN6.1 CN6.2 CN6.3 CN6.4 CN7.1 CN7.2 CN7.3 CN7.4 D3.2(A) DC1.2 DC1.3 FPC1.1 FPC1.4 FPC1.7 FPC1.10 FPC1.13 FPC1.16 FPC1.18 FPC1.27 FPC1.31 FPC1.32 L3.P10 LED1.2(-) R6.1 R7.1 R9.1 R16.1 R18.1 R20.1 R21.1 R41.1 R50.1 R51.2 R55.1 R56.1 R57.1 R61.1 R62.1 R64.1 R66.1 R68.1 R81.2 R147.1 R149.1 R151.1 R188.2 R192.1 R193.2 R198.1 rk3568_down.13 rk3568_down.15 rk3568_down.16 rk3568_down.17 rk3568_down.19 rk3568_down.21 rk3568_down.23 rk3568_down.33 rk3568_down.34 rk3568_down.35 rk3568_down.37 rk3568_down.39 rk3568_down.40 rk3568_down.41 rk3568_down.43 rk3568_down.53 rk3568_down.60 rk3568_down.62 rk3568_down.64 rk3568_down.66 rk3568_down.67 rk3568_down.69 rk3568_down.78 rk3568_down.79 rk3568_left.7 rk3568_left.18 rk3568_left.25 rk3568_left.35 rk3568_left.38 rk3568_left.49 rk3568_left.60 rk3568_left.73 rk3568_left.78 rk3568_right.1 rk3568_right.2 rk3568_right.7 rk3568_right.21 rk3568_right.22 rk3568_right.24 rk3568_right.26 rk3568_right.28 rk3568_right.30 rk3568_right.32 rk3568_right.34 rk3568_right.36 rk3568_right.38 rk3568_right.39 rk3568_right.40 rk3568_right.42 rk3568_right.44 rk3568_right.45 rk3568_right.46 rk3568_right.48 rk3568_right.50 rk3568_right.52 rk3568_right.54 rk3568_right.56 rk3568_right.58 rk3568_right.59 rk3568_right.60 rk3568_right.62 rk3568_right.64 rk3568_right.66 rk3568_right.68 rk3568_right.73 rk3568_right.79 rk3568_right.80 rk3568_up.1 rk3568_up.2 rk3568_up.12 rk3568_up.15 rk3568_up.33 rk3568_up.38 rk3568_up.48 rk3568_up.51 rk3568_up.66 rk3568_up.69 rk3568_up.79 rk3568_up.80 U2.1(BOOT) U3.2(PGND) U3.10(AGND) U4.1 U5.2(GND) U6.2 U7.2 U8.1 U9.1 U10.2 U11.2 U12.2 U13.2 U14.2 U15.2 U17.41(GND) U35.1(GND) U35.2(GND) U35.4(GND) U35.5(GND) U35.6(GND) U35.7(GND) U35.8(GND) U35.9(GND) U35.11(GND) U35.13(GND) U35.23(GND) U35.32(GND) U35.39(GND) U35.46(GND) U35.48(GND) U39.7(GND) U39.15(EP) USB3.1 USB3.2 USB3.3 USB3.4 USB3.A1(GND) USB3.A12(GND) USB3.B1(GND) USB3.B12(GND) USB4.4(GND) USB4.7(GND_DRAIN) USB4.10(GND) USB4.11(GND) USB5.4(GND) USB5.5(SHLD) USB6.4(GND) USB6.5(SHLD) USB7.2(TMDS Data 2 Shield) USB7.5(TMDS Data 1 Shield) USB7.8(TMDS Data 0 Shield) USB7.11(TMDS Clock Shield) USB7.14(Reserved (N.C.)) USB7.17(DDC/CEC Ground) USB7.20(GND) USB7.21(GND) USB7.22(GND) USB7.23(GND) X1.2(GND) X1.4(GND) ; also on sheet 7 8 9
VCC3V3_PHY1: C48.2 C49.2 C51.2 C52.2 C59.2 R58.2 R59.2 R70.2 R79.2 R190.1 U17.11(AVDD33) U17.29(DVDD33) U17.40(AVDD33)
VCC3V3_S5: C15.1 U3.6(LDO)
VCC3V3_SD: rk3568_left.51
VCC3V3_SYS: C17.1 C19.2 C20.2 C21.2 C102.2 C104.2 C105.2 FPC1.19 L2.1 Q1.1(G) Q2.1(G) R36.2 R38.1 R39.2 R53.2 R70.1 R71.1 R153.2 R195.2 rk3568_down.1 rk3568_down.3 rk3568_down.5 rk3568_down.7 rk3568_down.9 rk3568_down.11 U3.5(VOUT) U36.2 U37.1 U39.1(VCCA) ; also on sheet 7 8
VCC5V0_SYS: C9.2 C10.2 C22.2 C29.2 C30.2 C106.2 C107.2 D4.1(A) FPC1.28 FPC1.29 FPC1.30 L1.2 Q3.1(G) R8.2 R10.2 R19.2 rk3568_down.25 rk3568_down.27 rk3568_down.29 rk3568_down.31 U5.5(IN) USB4.1(VBUS) USB5.1(VCC) USB6.1(VCC) USB7.18(+5V Power) ; also on sheet 9
VCC5V0_USB_OTG0: C23.1 C24.2 R15.2 R19.1 R21.2 U5.1(OUT) USB3.A4(VBUS) USB3.A9(VBUS) USB3.B4(VBUS) USB3.B9(VBUS)
VCC12V_DCIN: C3.2 C4.2 C5.2 C6.1 C13.2 R5.2 R11.2 SW1.2 SW1.5 U2.3(EN) U3.1(VIN) ; also on sheet 7 9
VCCA1V8_PMU: R187.1 rk3568_left.80 U38.1
VCCIO_PHY1: C60.2 C61.2 C64.2 R63.2 R65.2 R67.2 R69.2 R71.2 R80.1 R187.2 U17.28(DVDD_RG)
VCCIO_WL: C98.2 C101.2 C103.1 Q7.1(G) R129.1 R137.2 R138.2 R139.2 R140.2 R141.2 R152.2 U35.34(VDDIO) U37.2 U38.2 U39.8(OE) U39.14(VCCB)
VDD10_PHY1: C41.2 C42.2 C43.2 C44.2 C45.2 C46.2 L4.2 U17.3(AVDD10) U17.8(AVDD10) U17.21(DVDD10) U17.38(AVDD10)
VDDA0V9_IMAGE: rk3568_left.75
BT_REG_ON: R148.2 R149.2 U35.38(BT_DIS_N)
BT_REG_ON_H_GPIO2_B7: R148.1 rk3568_right.15
BT_WAKE_HOST: Q7.2(S) R152.1 U35.50(BT_WAKE_HOST)
BT_WAKE_HOST_H_GPIO2_C0: Q7.3(D) R153.1 rk3568_right.11
EDP_TX_AUXN: rk3568_down.36
EDP_TX_AUXP: rk3568_down.38
EDP_TX_D0N: rk3568_down.30
EDP_TX_D0P: rk3568_down.32
EDP_TX_D1N: rk3568_down.26
EDP_TX_D1P: rk3568_down.28
EDP_TX_D2N: rk3568_down.22
EDP_TX_D2P: rk3568_down.24
EDP_TX_D3N: rk3568_down.18
EDP_TX_D3P: rk3568_down.20
ETH1_REFCLKO_25M_GPIO4_B3: R48.2 rk3568_right.41
FLASH_VOL_SEL_GPIO0_A7: rk3568_left.14
GMAC1_INT/PMEB_GPIO3_A7: R195.1 rk3568_up.47 U17.31(INTB/PMEB)
GMAC1_MCLKINOUT_GPIO4_C1: R49.2 R50.2 rk3568_right.43
GMAC1_MDC_GPIO4_B6: rk3568_right.77 U17.13(MDC)
GMAC1_MDIO_GPIO4_B7: R80.2 rk3568_right.75 U17.14(MDIO)
GMAC1_RSTN_GPIO3_B0: R78.2 rk3568_up.49
GMAC1_RXCLK_GPIO4_A3: R86.2 rk3568_right.47
GMAC1_RXD0_GPIO4_A7: R82.2 rk3568_right.51
GMAC1_RXD1_GPIO4_B0: R83.2 rk3568_right.53
GMAC1_RXD2_GPIO4_A1: R84.2 rk3568_right.55
GMAC1_RXD3_GPIO4_A2: R85.2 rk3568_right.57
GMAC1_RXDV_CRS_GPIO4_B1: R87.2 rk3568_right.49
GMAC1_TXCLK_GPIO4_A0: rk3568_right.61 U17.20(TXC)
GMAC1_TXD0_GPIO4_A4: rk3568_right.65 U17.18(TXD0)
GMAC1_TXD1_GPIO4_A5: rk3568_right.67 U17.17(TXD1)
GMAC1_TXD2_GPIO3_D6: rk3568_right.69 U17.16(TXD2)
GMAC1_TXD3_GPIO3_D7: rk3568_right.71 U17.15(TXD3)
GMAC1_TXEN_GPIO4_A6: rk3568_right.63 U17.19(TXCTL)
GPIO0_B0: rk3568_left.67 ; also on sheet 8
GPIO0_D3: rk3568_left.26 ; also on sheet 8
GPIO0_D6: rk3568_left.30 ; also on sheet 8
GPIO1_A4: rk3568_down.58 ; also on sheet 8
GPIO1_B0: rk3568_down.46 ; also on sheet 8
GPIO1_B1: rk3568_down.48 ; also on sheet 8
GPIO1_B2: rk3568_down.50 ; also on sheet 8
GPIO2_C6: rk3568_right.4 ; also on sheet 8
GPIO3_A2: rk3568_up.37 ; also on sheet 8
GPIO3_A3: rk3568_up.39 ; also on sheet 8
GPIO3_A4: rk3568_up.41 ; also on sheet 8
GPIO3_A5: rk3568_up.43 ; also on sheet 8
GPIO3_B3: rk3568_up.57 ; also on sheet 8
GPIO3_B4: rk3568_up.59 ; also on sheet 8
GPIO3_B6: rk3568_up.63 ; also on sheet 8
GPIO3_D0: rk3568_up.28 ; also on sheet 8
GPIO3_D2: rk3568_up.36 ; also on sheet 8
GPIO3_D3: rk3568_up.34 ; also on sheet 8
GPIO3_D4: rk3568_up.32 ; also on sheet 8
GPIO3_D5: rk3568_up.26 ; also on sheet 8
GPIO4_C0: rk3568_up.22 ; also on sheet 8
GPIO4_C3: rk3568_up.16 ; also on sheet 8
GPIO4_C4: rk3568_right.78 ; also on sheet 8
GPIO4_D2: rk3568_up.24 ; also on sheet 8
HDMI_TX0N_PORT: rk3568_left.13 USB7.9(TMDS Data 0-)
HDMI_TX0P_PORT: rk3568_left.15 USB7.7(TMDS Data 0+)
HDMI_TX1N_PORT: rk3568_left.17 USB7.6(TMDS Data 1-)
HDMI_TX1P_PORT: rk3568_left.19 USB7.4(TMDS Data 1+)
HDMI_TX2N_PORT: rk3568_left.21 USB7.3(TMDS Data 2-)
HDMI_TX2P_PORT: rk3568_left.23 USB7.1(TMDS Data 2+)
HDMI_TX_CEC_PORT: Q3.3(D) USB7.13(CEC)
HDMI_TX_HPD_PORT: R40.1 R41.2 USB7.19(Hot Plug Detect)
HDMI_TX_HPDIN: R40.2 rk3568_left.63
HDMI_TXCLKN_PORT: rk3568_left.9 USB7.12(TMDS Clock-)
HDMI_TXCLKP_PORT: rk3568_left.11 USB7.10(TMDS Clock+)
HDMI_TXDDC_SCL_PORT: Q1.3(D) R35.2 USB7.15(SCL)
HDMI_TXDDC_SDA_PORT: Q2.3(D) R37.1 USB7.16(SDA)
HDMITX_CEC_GPIO4_D1: Q3.2(S) R39.1 rk3568_left.5
HDMITX_I2C5_SCL_GPIO4_C7: Q1.2(S) R38.2 rk3568_left.3
HDMITX_I2C5_SDA_GPIO4_D0: Q2.2(S) R36.1 rk3568_left.1
HOST_WAKE_BT: R150.2 R151.2 U35.49(HOST_WAKE_BT)
HOST_WAKE_BT_H_GPIO2_C1: R150.1 rk3568_right.3
HP_DET_L_GPIO3_A6: rk3568_up.45 ; also on sheet 7
HP_SNS: rk3568_down.4
HPL_OUT: rk3568_down.2 ; also on sheet 7
HPR_OUT: rk3568_down.6 ; also on sheet 7
I2C1_SCL_TP_GPIO0_B3: FPC1.23 rk3568_left.59
I2C1_SDA_TP_GPIO0_B4: FPC1.24 rk3568_left.61
I2C3_SCL_GPIO1_A1: rk3568_down.54 ; also on sheet 8
I2C3_SDA_GPIO1_A0: rk3568_down.56 ; also on sheet 8
I2C4_SCL_GPIO2_B2: rk3568_right.8 ; also on sheet 8
I2C4_SDA_GPIO2_B1: rk3568_right.10 ; also on sheet 8
LCD_BL_PWM5_GPIO0_C4: FPC1.17 rk3568_left.53
LCD_EN_H_GPIO3_C6: FPC1.22 rk3568_up.30
LCD_RST_L_GPIO3_C7: FPC1.20 rk3568_left.55
MIC1_INN: rk3568_down.8 ; also on sheet 7
MIC1_INP: rk3568_down.10 ; also on sheet 7
MIPI_CSI_RX_CLK0N: rk3568_up.46
MIPI_CSI_RX_CLK0P: rk3568_up.44
MIPI_CSI_RX_CLK1N: rk3568_up.42
MIPI_CSI_RX_CLK1P: rk3568_up.40
MIPI_CSI_RX_D0N: rk3568_up.52
MIPI_CSI_RX_D0P: rk3568_up.50
MIPI_CSI_RX_D1N: rk3568_up.56
MIPI_CSI_RX_D1P: rk3568_up.54
MIPI_CSI_RX_D2N: rk3568_up.60
MIPI_CSI_RX_D2P: rk3568_up.58
MIPI_CSI_RX_D3N: rk3568_up.64
MIPI_CSI_RX_D3P: rk3568_up.62
MIPI_DSI_TX0_CLKN/LVDS_TX0_CLKN: rk3568_up.73
MIPI_DSI_TX0_CLKP/LVDS_TX0_CLKP: rk3568_up.71
MIPI_DSI_TX0_D0N/LVDS_TX0_D0N: rk3568_up.74
MIPI_DSI_TX0_D0P/LVDS_TX0_D0P: rk3568_up.72
MIPI_DSI_TX0_D1N/LVDS_TX0_D1N: rk3568_up.70
MIPI_DSI_TX0_D1P/LVDS_TX0_D1P: rk3568_up.68
MIPI_DSI_TX0_D2N/LVDS_TX0_D2N: rk3568_up.77
MIPI_DSI_TX0_D2P/LVDS_TX0_D2P: rk3568_up.75
MIPI_DSI_TX0_D3N/LVDS_TX0_D3N: rk3568_up.78
MIPI_DSI_TX0_D3P/LVDS_TX0_D3P: rk3568_up.76
MIPI_DSI_TX1_CLKN: FPC1.8 rk3568_left.37
MIPI_DSI_TX1_CLKP: FPC1.9 rk3568_left.39
MIPI_DSI_TX1_D0N: FPC1.14 rk3568_left.45
MIPI_DSI_TX1_D0P: FPC1.15 rk3568_left.47
MIPI_DSI_TX1_D1N: FPC1.11 rk3568_left.41
MIPI_DSI_TX1_D1P: FPC1.12 rk3568_left.43
MIPI_DSI_TX1_D2N: FPC1.5 rk3568_left.31
MIPI_DSI_TX1_D2P: FPC1.6 rk3568_left.33
MIPI_DSI_TX1_D3N: FPC1.2 rk3568_left.27
MIPI_DSI_TX1_D3P: FPC1.3 rk3568_left.29
PCIE20_REFCLKN_IN: rk3568_left.62
PCIE20_REFCLKP_IN: rk3568_left.64
PCIE20_RXN: rk3568_left.66
PCIE20_RXP: rk3568_left.68
PCIE20_TXN: rk3568_left.70
PCIE20_TXP: rk3568_left.72
PCIE30_REFCLKN_IN: rk3568_left.58 ; also on sheet 9
PCIE30_REFCLKP_IN: rk3568_left.56 ; also on sheet 9
PCIE30_RX0N: rk3568_left.44 ; also on sheet 9
PCIE30_RX0P: rk3568_left.46 ; also on sheet 9
PCIE30_RX1N: rk3568_left.40 ; also on sheet 9
PCIE30_RX1P: rk3568_left.42 ; also on sheet 9
PCIE30_TX0N: rk3568_left.52 ; also on sheet 9
PCIE30_TX0P: rk3568_left.54 ; also on sheet 9
PCIE30_TX1N: rk3568_left.48 ; also on sheet 9
PCIE30_TX1P: rk3568_left.50 ; also on sheet 9
PCIE30X2_CLKREQN_GPIO0_A6: rk3568_left.24 ; also on sheet 9
PCIE30X2_PRSTN_GPIO0_C6: rk3568_left.8 ; also on sheet 9
PCIE30X2_WAKEN_GPIO0_D5: rk3568_left.69 ; also on sheet 9
PCIE_PWREN_H_GPIO0_D4: rk3568_left.32 ; also on sheet 9
PCIECLKIC_OE_H_GPIO0_A4: rk3568_left.36 ; also on sheet 9
PCM_CLK: R145.1 U39.2(A1)
PCM_RX: R144.1 U39.3(A2)
PCM_SYNC: R142.1 U39.5(A4)
PCM_TX: R143.1 U39.4(A3)
PHY1_CLKOUT125: R49.1 R194.2 U17.35(CLKOUT)
PHY1_G_LED-: LED5.2(-) R188.1
PHY1_LED0/CFG_EXT: R55.2 R58.1 U17.32(CFG_EXT/LED0)
PHY1_LED1/CFG_LDO0: C132.2 LED5.1(+) R57.2 U17.33(CFG_LDO0/LED1)
PHY1_LED2/CFG_LDO1: C133.2 L3.13 R56.2 R59.1 R189.2 R191.2 R193.1 U17.34(CFG_LDO1/LED2)
PHY1_MDI0+: L3.P2(MDI0+) U17.1(MDIP0)
PHY1_MDI0-: L3.P3(MDI0-) U17.2(MDIN0)
PHY1_MDI1+: L3.P4(MDI1+) U17.4(MDIP1)
PHY1_MDI1-: L3.P7(MDI1-) U17.5(MDIN1)
PHY1_MDI2+: L3.P5(MDI2+) U17.6(MDIP2)
PHY1_MDI2-: L3.P6(MDI2-) U17.7(MDIN2)
PHY1_MDI3+: L3.P8(MDI3+) U17.9(MDIP3)
PHY1_MDI3-: L3.P9(MDI3-) U17.10(MDIN3)
PHY1_REG_OUT: L4.1 U17.30(REG_OUT/LDO_OUT)
PHY1_RSTN: C67.2 R78.1 R79.1 U17.12(PHYRSTB)
PHY1_RXCLK/PHYAD1: R61.2 R86.1 U17.27(PHYAD1/RXC)
PHY1_RXD0/RXDLY: R64.2 R65.1 R82.1 U17.25(RXDLY/RXD0)
PHY1_RXD1/TXDLY: R66.2 R67.1 R83.1 U17.24(TXDLY/RXD1)
PHY1_RXD2/PLLOFF: R68.2 R69.1 R84.1 U17.23(PLLOFF/RXD2)
PHY1_RXD3/PHYAD0: R63.1 R85.1 R198.2 U17.22(PHYAD0/RXD3)
PHY1_RXDV/PHYAD2: R62.2 R87.1 U17.26(PHYAD2/RXCTL)
PHY1_XTALIN: C38.1 U17.36(XTAL_IN) X1.3(OSC2)
PHY1_XTALOUT: C37.2 R48.1 U17.37(XTAL_OUT/EXT_CLK) X1.1(OSC1)
PHY1_Y_LED-: LED6.1(+) R190.2 R191.1
PWM0_GPIO0_C7: rk3568_left.22 ; also on sheet 8
PWM1_GPIO0_C0: rk3568_left.71 ; also on sheet 8
PWM2_GPIO0_C1: rk3568_left.12 ; also on sheet 8
PWM3_IR_GPIO0_C2: rk3568_left.2 ; also on sheet 7
PWM4_FAN_GPIO0_C3: rk3568_left.65 ; also on sheet 7
PWM6_GPIO0_C5: rk3568_left.57 ; also on sheet 8
PWM8_GPIO1_D5: rk3568_down.74 ; also on sheet 8
PWM9_GPIO1_D6: rk3568_down.72 ; also on sheet 8
PWM10_GPIO3_B5: rk3568_up.61 ; also on sheet 8
PWM14_GPIO4_C2: rk3568_up.14 ; also on sheet 8
REFCLK_OUT_GPIO0_A0: rk3568_left.16
RESET1: R81.1 U17.39(RSET)
RESETN: rk3568_left.76 ; also on sheet 7
RK809_32KOUT_WIFI: R146.1 rk3568_left.79
RK809_PWRON: rk3568_down.42 ; also on sheet 7
RK809_VDC: rk3568_left.74
RTC_I2C2_SCL_GPIO4_B5: rk3568_up.18 ; also on sheet 7
RTC_I2C2_SDA_GPIO4_B4: rk3568_up.20 ; also on sheet 7
SARADC_VIN0_KEY_RECOVERY: rk3568_down.44 ; also on sheet 7
SARADC_VIN1_HW_ID: rk3568_right.6 ; also on sheet 7
SARADC_VIN2: rk3568_right.14 ; also on sheet 8
SARADC_VIN3_BOM_ID: rk3568_right.16 ; also on sheet 7
SARADC_VIN4: rk3568_right.20 ; also on sheet 8
SARADC_VIN5: rk3568_right.12 ; also on sheet 8
SARADC_VIN6: rk3568_down.52 ; also on sheet 8
SARADC_VIN7: rk3568_right.18 ; also on sheet 8
SDMMC1_CLK_GPIO2_B0: R132.1 rk3568_right.23
SDMMC1_CMD_GPIO2_A7: R131.1 R137.1 rk3568_right.33
SDMMC1_D0_GPIO2_A3: R135.1 R140.1 rk3568_right.17
SDMMC1_D1_GPIO2_A4: R136.1 R141.1 rk3568_right.19
SDMMC1_D2_GPIO2_A5: R134.1 R139.1 rk3568_right.9
SDMMC1_D3_GPIO2_A6: R133.1 R138.1 rk3568_right.31
SOC_PCM_CLK_GPIO2_C2: rk3568_right.5 U39.13(B1)
SOC_PCM_IN_GPIO2_C5: rk3568_left.77 U39.12(B2)
SOC_PCM_OUT_GPIO2_C4: rk3568_right.35 U39.11(B3)
SOC_PCM_SYNC_GPIO2_C3: rk3568_right.37 U39.10(B4)
SPI0_CLK_GPIO2_D3: rk3568_up.23 ; also on sheet 8
SPI0_CS0_GPIO2_D2: rk3568_up.21 ; also on sheet 8
SPI0_MISO_GPIO2_D0: rk3568_up.17 ; also on sheet 8
SPI0_MOSI_GPIO2_D1: rk3568_up.19 ; also on sheet 8
SPI1_CLK_GPIO3_C3: rk3568_up.13 ; also on sheet 8
SPI1_CS0_GPIO3_A1: rk3568_up.35 ; also on sheet 8
SPI1_MISO_GPIO3_C2: rk3568_up.11 ; also on sheet 8
SPI1_MOSI_GPIO3_C1: rk3568_up.7 ; also on sheet 8
SPI2_CLK_GPIO3_A0: rk3568_up.9 ; also on sheet 8
SPI2_CS0_GPIO2_D5: rk3568_up.27 ; also on sheet 8
SPI2_CS1_GPIO2_D4: rk3568_up.25 ; also on sheet 8
SPI2_MISO_GPIO2_D7: rk3568_up.31 ; also on sheet 8
SPI2_MOSI_GPIO2_D6: rk3568_up.29 ; also on sheet 8
SPKN_OUT: rk3568_down.12 ; also on sheet 7
SPKP_OUT: rk3568_down.14 ; also on sheet 7
TP_INT_L_GPIO0_B5: FPC1.25 rk3568_left.10
TP_RST_L_GPIO0_B6: FPC1.26 rk3568_left.34
UART1_CTSN_GPIO2_B6: R147.2 rk3568_right.13 U35.42(UART_RTS)
UART1_RTSN_GPIO2_B5: rk3568_right.25 U35.43(UART_CTS)
UART1_RX_GPIO2_B3: rk3568_right.27 U35.40(UART_TXD)
UART1_TX_GPIO2_B4: rk3568_right.29 U35.41(UART_RXD)
UART2_RX_DEBUG_GPIO0_D0: rk3568_left.4 ; also on sheet 7
UART2_TX_DEBUG_GPIO0_D1: rk3568_left.6 ; also on sheet 7
UART3_RX_GPIO3_C0: rk3568_up.67 ; also on sheet 8
UART3_TX_GPIO3_B7: rk3568_up.65 ; also on sheet 8
UART4_RX_GPIO3_B1: rk3568_up.53 ; also on sheet 8
UART4_TX_GPIO3_B2: rk3568_up.55 ; also on sheet 8
UART5_CTSN_GPIO1_D7: rk3568_down.70 ; also on sheet 8
UART5_RTSN_GPIO2_A0: rk3568_down.68 ; also on sheet 8
UART5_RX_GPIO2_A1: rk3568_down.76 ; also on sheet 8
UART5_TX_GPIO2_A2: rk3568_down.80 ; also on sheet 8
UART7_RX_GPIO3_C5: rk3568_up.3 ; also on sheet 8
UART7_TX_GPIO3_C4: rk3568_up.5 ; also on sheet 8
UART9_RX_GPIO4_C6: rk3568_right.74 ; also on sheet 8
UART9_TX_GPIO4_C5: rk3568_right.76 ; also on sheet 8
USB2_HOST2_DM: R30.2 rk3568_up.6
USB2_HOST2_DP: R31.2 rk3568_up.4
USB2_HOST3_DM: R32.2 rk3568_up.10
USB2_HOST3_DP: R33.2 rk3568_up.8
USB3_HOST1_DM: R29.2 rk3568_down.57
USB3_HOST1_DP: R28.2 rk3568_down.55
USB3_HOST1_SSRXN: R27.2 rk3568_down.71
USB3_HOST1_SSRXP: R26.2 rk3568_down.73
USB3_HOST1_SSTXN: C27.2 rk3568_down.75
USB3_HOST1_SSTXP: C28.2 rk3568_down.77
USB3_OTG0_DM: R24.2 rk3568_down.51
USB3_OTG0_DP: R25.2 rk3568_down.49
USB3_OTG0_ID: R17.1 rk3568_down.47
USB3_OTG0_SSRXN: R22.2 rk3568_down.59
USB3_OTG0_SSRXP: R23.2 rk3568_down.61
USB3_OTG0_SSTXN: C25.2 rk3568_down.63
USB3_OTG0_SSTXP: C26.2 rk3568_down.65
USB3_OTG0_VBUSDET: R15.1 R16.2 rk3568_down.45
USB3_OTG0DM: R24.1 U10.1 USB3.A7(DN1) USB3.B7(DN2)
USB3_OTG0DP: R25.1 U11.1 USB3.A6(DP1) USB3.B6(DP2)
USB3_OTG0ID: R17.2 U4.2 USB3.A5(CC1) USB3.B5(CC2)
USB3_OTG0SSRXN: R22.1 U7.1 USB3.A10(SSRXN2) USB3.B10(SSRXN1)
USB3_OTG0SSRXP: R23.1 U6.1 USB3.A11(SSRXP2) USB3.B11(SSRXP1)
USB3_OTG0SSTXN: C25.1 U8.2 USB3.A3(SSTXN1) USB3.B3(SSTXN2)
USB3_OTG0SSTXP: C26.1 U9.2 USB3.A2(SSTXP1) USB3.B2(SSTXP2)
USB_OTG_PWREN_H_GPIO0_A5: R18.2 rk3568_left.28 U5.4(EN)
WIFI_REG_ON_H_GPIO4_B2: rk3568_right.72 U35.44(WL_DIS_N)
WIFI_WAKE_HOST_H_GPIO3_D1: rk3568_right.70 U35.16(WL_WAKE_HOST)
WORKING_LEDEN_H_GPIO0_B7: rk3568_left.20 ; also on sheet 7
Net-(C7-2): C7.2 U2.6(COMP)
Net-(C8-1): C8.1 U2.2(VIN)
Net-(C8-2): C8.2 D3.1(K) L1.1 U2.8(PH)
Net-(C11-1): C11.1 R7.2
Net-(C11-2): C11.2 C12.2 U2.5(VSENSE)
Net-(C16-2): C16.2 R13.1 U3.9(VCC)
Net-(C18-1): C18.1 R14.1
Net-(C18-2): C18.2 L2.2 U3.7(SW)
Net-(C27-1): C27.1 USB4.8(STDA_SSTX-)
Net-(C28-1): C28.1 USB4.9(STDA_SSTX+)
Net-(C39-2): C39.2 L3.P1
Net-(C40-2): C40.2 L3.SHIELD0 L3.SHIELD1
Net-(C93-1): C93.1 U35.3(ANT2)
Net-(C93-2): C93.2 CN5.5
Net-(C96-1): C96.1 CN6.5
Net-(C96-2): C96.2 U35.10(ANT1)
Net-(C97-1): C97.1 U35.12(RF_BT)
Net-(C97-2): C97.2 CN7.5
Net-(C99-2): C99.2 C100.2 U35.36(VCC33) U36.1
Net-(D4-2): D4.2(K) R35.1 R37.2
Net-(DC1-1): DC1.1 SW1.1 SW1.4
Net-(L3-11): L3.11 R194.1
Net-(L3-12): L3.12 R51.1
Net-(L3-14): L3.14 R53.1
Net-(LED1-1): LED1.1(+) R10.1
Net-(LED6-2): LED6.2(-) R189.1 R192.2
Net-(R5-1): R5.1 R6.2 U2.4(SS)
Net-(R8-1): R8.1 R9.2 U2.7(GND)
Net-(R11-1): R11.1 U3.11(EN)
Net-(R13-2): R13.2 U3.3(PG)
Net-(R14-2): R14.2 U3.8(BST)
Net-(R20-2): R20.2 U5.3(ISET)
Net-(R26-1): R26.1 USB4.6(STDA_SSRX+)
Net-(R27-1): R27.1 USB4.5(STDA_SSRX-)
Net-(R28-1): R28.1 USB4.3(D+)
Net-(R29-1): R29.1 USB4.2(D-)
Net-(R30-1): R30.1 U12.1 USB5.2(D-)
Net-(R31-1): R31.1 U13.1 USB5.3(D+)
Net-(R32-1): R32.1 U14.1 USB6.2(D-)
Net-(R33-1): R33.1 U15.1 USB6.3(D+)
Net-(R129-2): R129.2 U35.15(SD_RESET)
Net-(R131-2): R131.2 U35.17(SDIO_CMD)
Net-(R132-2): R132.2 U35.18(SDIO_CLK)
Net-(R133-2): R133.2 U35.19(SDIO_DATA3)
Net-(R134-2): R134.2 U35.20(SDIO_DATA2)
Net-(R135-2): R135.2 U35.21(SDIO_DATA0)
Net-(R136-2): R136.2 U35.22(SDIO_DATA1)
Net-(R142-2): R142.2 U35.27(PCM_SYNC)
Net-(R143-2): R143.2 U35.28(PCM_IN)
Net-(R144-2): R144.2 U35.29(PCM_OUT)
Net-(R145-2): R145.2 U35.30(PCM_CLK)
Net-(R146-2): R146.2 U35.31(SUSCLK)

Not connected (* = marked no-connect by the designer): FPC1 21*; SW1 3* 6*; U3 4(CLK)* 12(EN_CLK)*; U35 14(G_BT)* 24(NC)* 25(NC)* 26(NC)* 33(NC)* 35(NC)* 37(NC)* 45(G_WL)* 47(NC)*; U39 6(NC)* 9(NC)*; USB3 A8(SBU1)* B8(SBU2)*

## Notes on the sheets
sheet 1
- BOTTOM IO
sheet 2
- 12V/3A DCIN
- VCC5V0_SYS
- DC/DC 3.3V
- VCC3V3_SYS
sheet 3
- USB3.0 OTG
- USB3.0 HOST1
- USB2.0 HOST2
- USB2.0 HOST3
sheet 4
- HDMI2.0 TX
- MIPI LCD
sheet 5
- WIFI BT
sheet 6
- GMAC1 PHY
